# EasyEDA Pro project 电源板48-24 (0524).eprj, board PCB
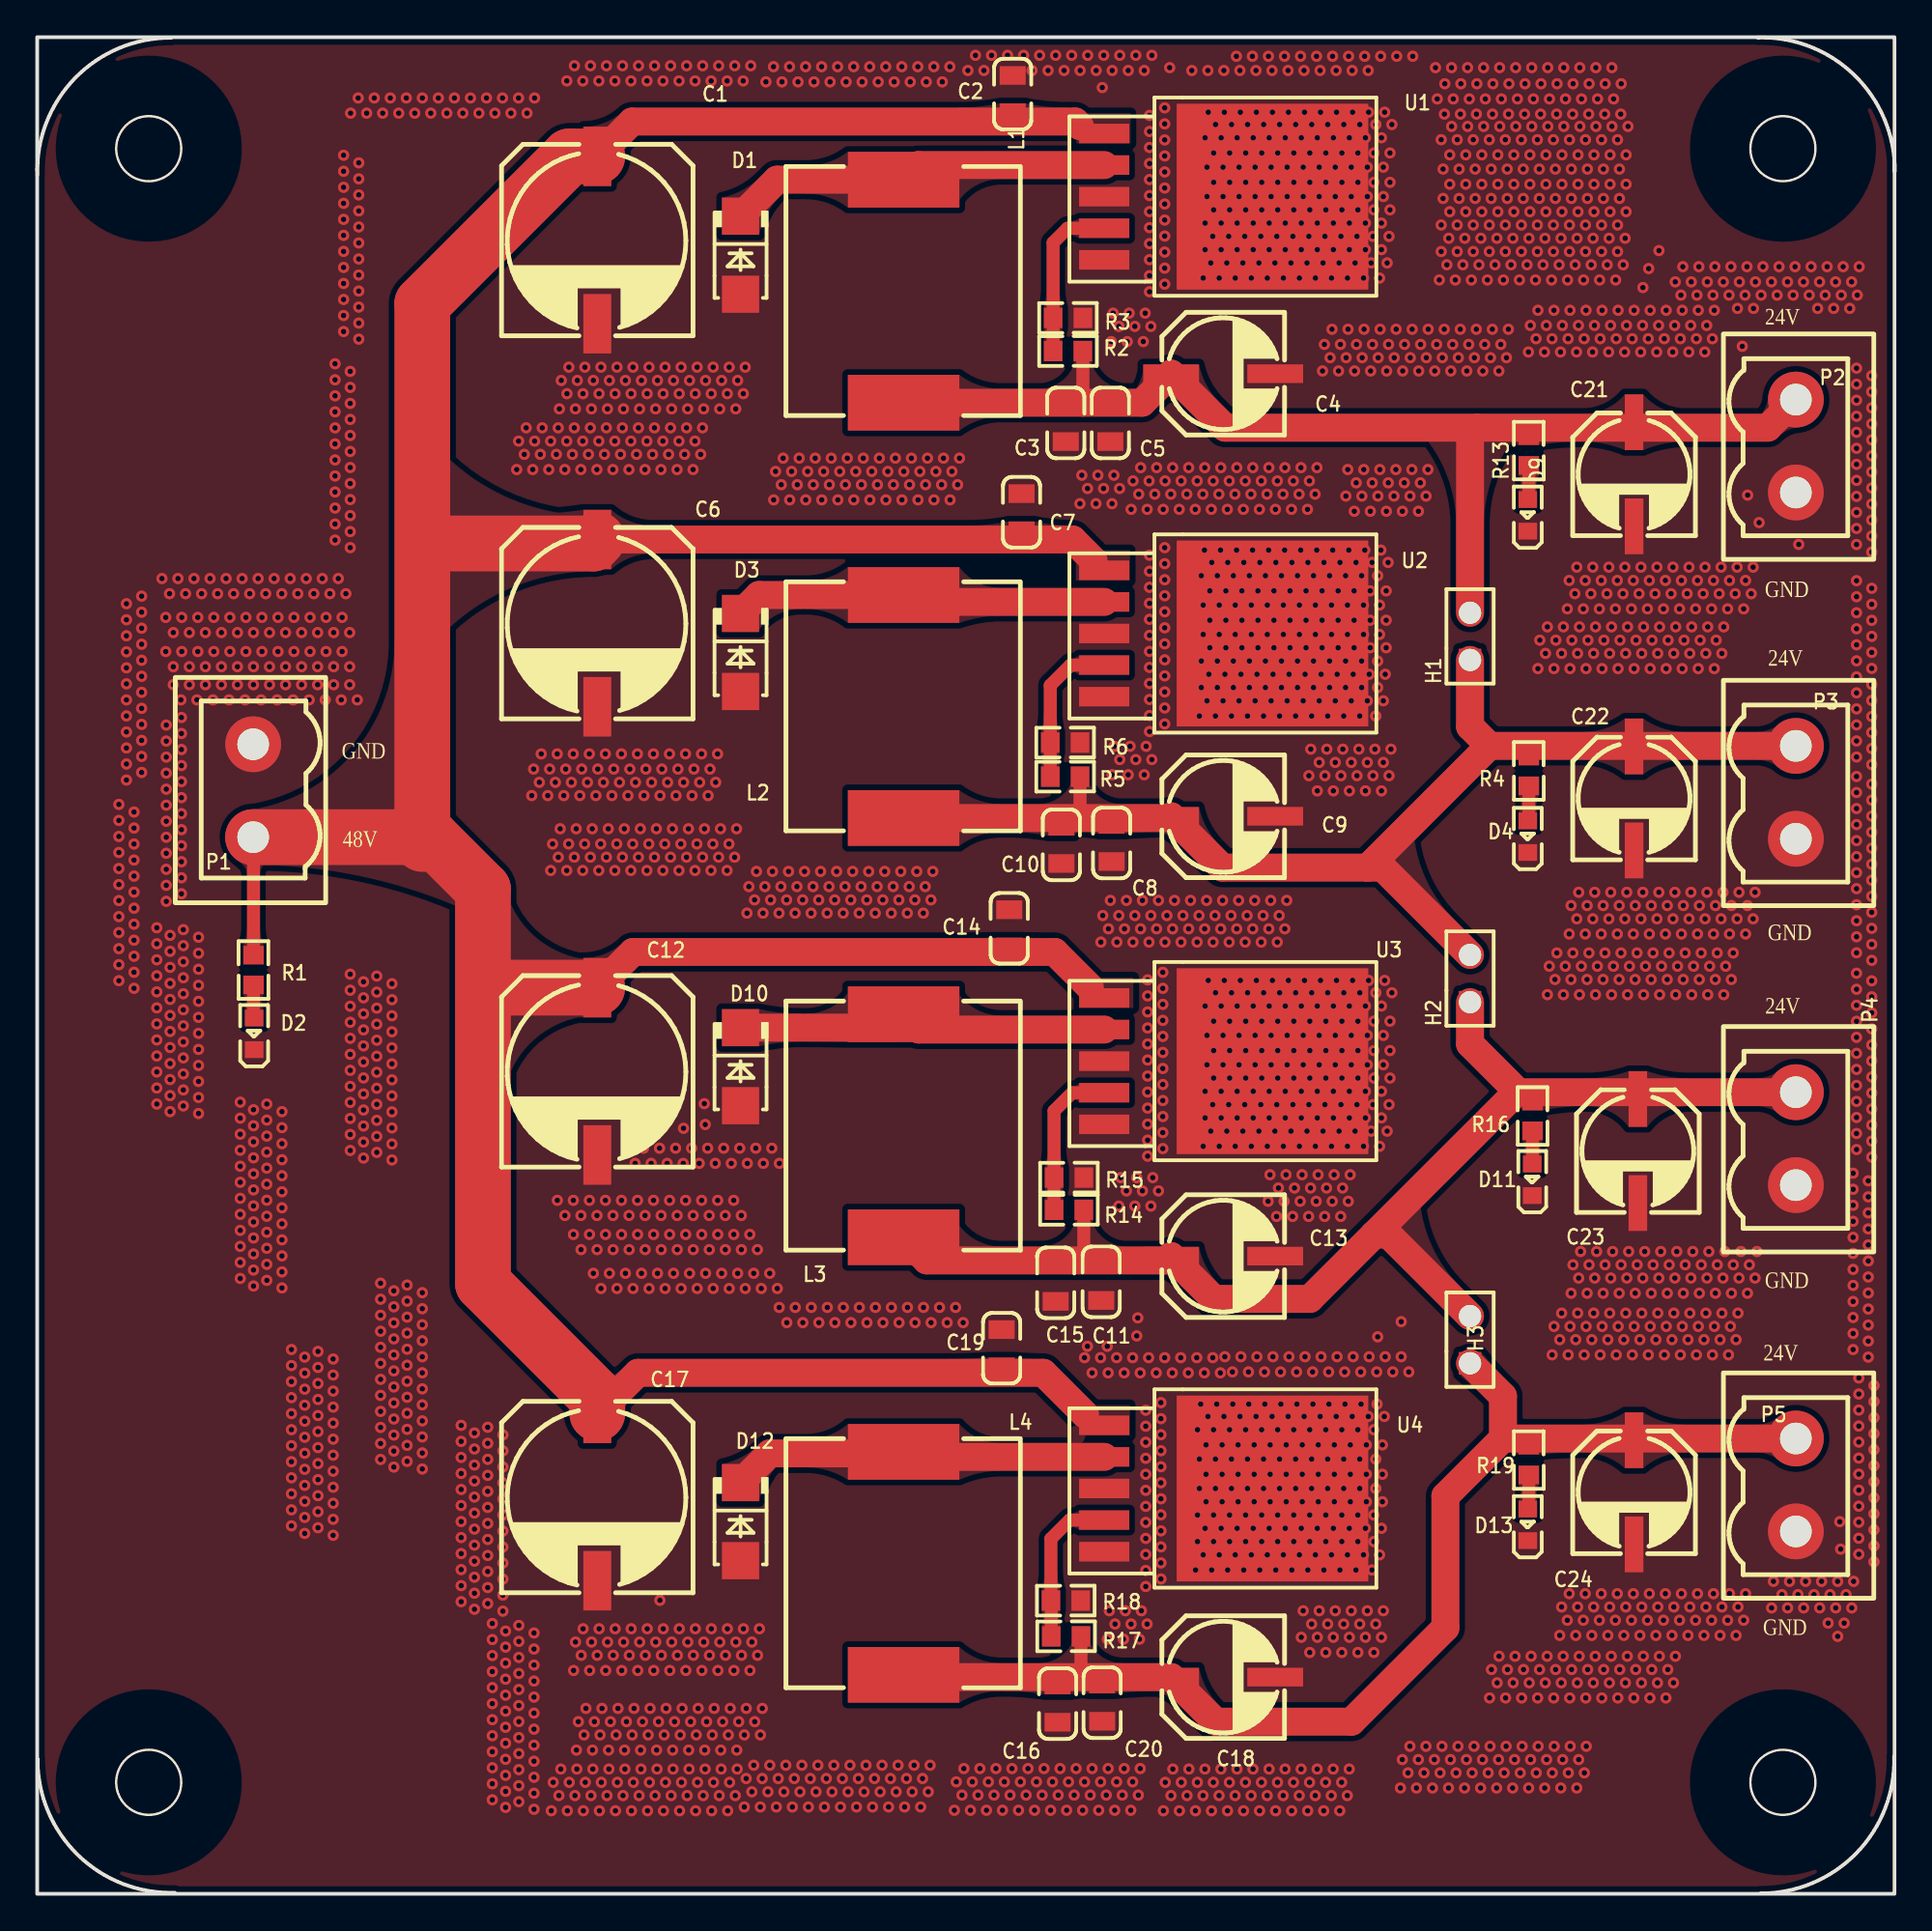
[diagram p1: board, top side]
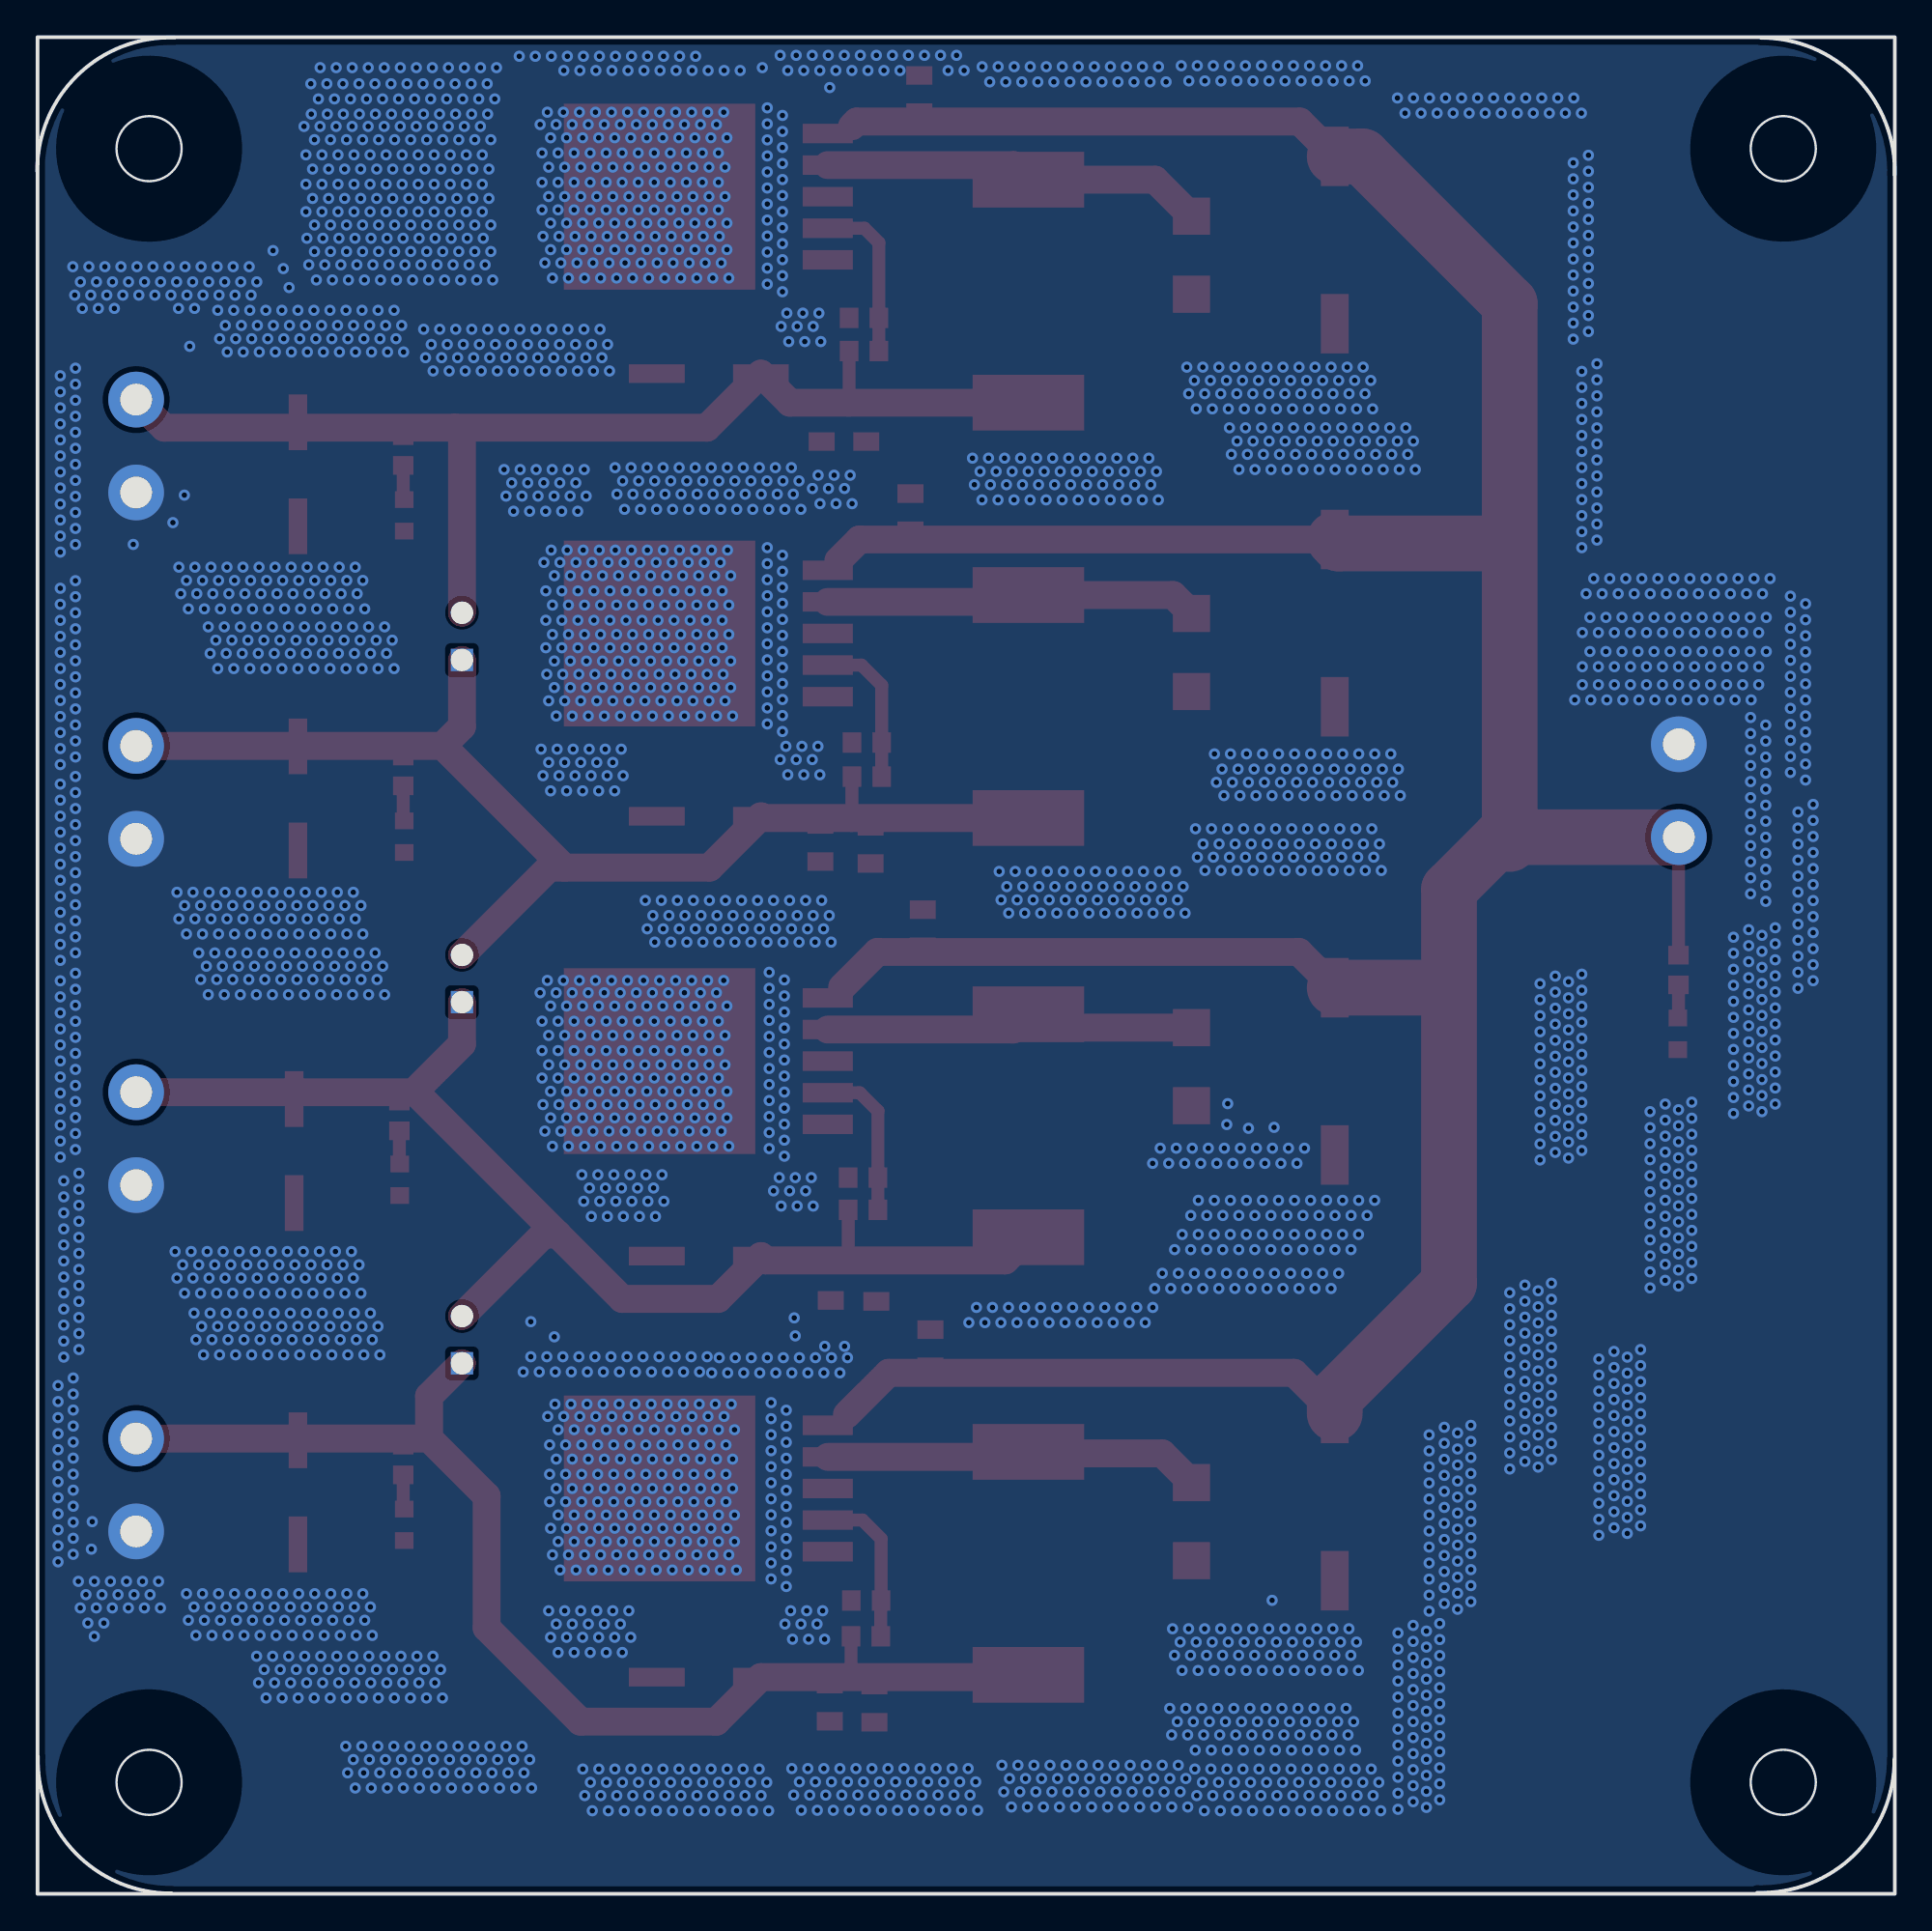
[diagram p2: board, bottom side, seen from below]

Outline 99.92 x 99.9 mm; copper layers: Top Layer, Bottom Layer. Coordinates in mm from the lower left corner of the outline.
Outline path: rectangle 0,99.9 99.9,0 ; circle c6,93.9 r1.75 ; circle c6,6 r1.75 ; circle c93.9,93.9 r1.75 ; circle c93.9,6 r1.75 ; 0.01,92.49 arc(2.04,97.7) 7.2,99.87 ; 7.4,0.06 arc(2.19,2.09) 0.02,7.25 ; 92.54,99.88 arc(97.75,97.85) 99.92,92.69 ; 99.88,7.4 arc(97.85,2.19) 92.69,0.02
Stack: Top Layer 0.035mm / Dielectric1 1.51mm FR4 er 4.5 / Bottom Layer 0.035mm

## Design rules (mm)
template: 用户自定义配置
spacing Default (default): track to track 0.152, other pairs 0 to 0.152
track width Default (default): min 0.254, default 0.254, max 25.4
differential pair differentialPair (default): width min 0.127, default 0.254, max 2.54; gap min 0.152, default 0.152
via Default (default): diameter min 0.25, default 0.61, max 100.025; hole min 0.2, default 0.305, max 59.995

## Placement (name value [footprint] x y rotation side)
C1  100uF/63V  [电解电容贴片10x10]  30.03 89.24 270 top
C2  104  [0805C]  52.47 96.84 270 top
C3  104  [0805C]  55.33 79.14 90 top
C4  100uF/35V  [电解电容贴片6X6]  63.79 81.79 0 top
C5  105  [0805C]  57.72 79.14 270 top
C6  100uF/63V  [电解电容贴片10x10]  30.03 68.63 270 top
C7  104  [0805C]  52.95 74.34 270 top
C8  104  [0805C]  57.79 56.54 90 top
C9  100uF/35V  [电解电容贴片6X6]  63.79 57.98 0 top
C10  105  [0805C]  55.09 56.44 270 top
C11  104  [0805C]  57.23 32.93 90 top
C12  100uF/63V  [电解电容贴片10x10]  30.03 44.51 270 top
C13  100uF/35V  [电解电容贴片6X6]  63.79 34.31 0 top
C14  104  [0805C]  52.28 51.95 270 top
C15  105  [0805C]  54.78 32.88 270 top
C16  104  [0805C]  54.88 10.23 90 top
C17  100uF/63V  [电解电容贴片10x10]  30.03 21.61 270 top
C18  100uF/35V  [电解电容贴片6X6]  63.79 11.66 0 top
C19  104  [0805C]  51.88 29.36 270 top
C20  105  [0805C]  57.28 10.28 270 top
C21  100uF/35V  [电解电容贴片6X6]  85.89 76.38 270 top
C22  100uF/35V  [电解电容贴片6X6]  85.89 58.94 270 top
C23  100uF/35V  [电解电容贴片6X6]  86.1 39.97 270 top
C24  100uF/35V  [电解电容贴片6X6]  85.89 21.61 270 top
D1  SS56  [SMA]  37.83 88.17 270 top
D2  红光  [0603LED]  11.69 46.24 270 top
D3  SS56  [SMA]  37.83 66.79 270 top
D4  红光  [0603LED]  80.19 56.85 270 top
D9  红光  [0603LED]  80.19 74.14 270 top
D10  SS56  [SMA]  37.83 44.51 270 top
D11  红光  [0603LED]  80.44 38.39 270 top
D12  SS56  [SMA]  37.83 20.03 270 top
D13  红光  [0603LED]  80.19 19.82 270 top
H1  PZ254V-11-02P  [HDR-TH_2P-P2.54-V-M]  77.07 67.66 90 top
H2  PZ254V-11-02P  [HDR-TH_2P-P2.54-V-M]  77.07 49.25 90 top
H3  PZ254V-11-02P  [HDR-TH_2P-P2.54-V-M]  77.07 29.82 90 top
L1  47uH/5A  [IND-SMD_L13.45-W12.6]  46.6 86.23 270 top
L2  47uH/5A  [IND-SMD_L13.45-W12.6]  46.6 63.89 270 top
L3  47uH/5A  [IND-SMD_L13.45-W12.6]  46.6 41.33 270 top
L4  47uH/5A  [IND-SMD_L13.45-W12.6]  46.6 17.78 270 top
P1  5.08-2P  [CONN-TH_WJ2EDGVC-5.08-2P]  11.62 59.35 90 top
P2  5.08-2P  [CONN-TH_WJ2EDGVC-5.08-2P]  94.6 77.9 270 top
P3  5.08-2P  [CONN-TH_WJ2EDGVC-5.08-2P]  94.6 59.27 270 top
P4  5.08-2P  [CONN-TH_WJ2EDGVC-5.08-2P]  94.6 40.63 270 top
P5  5.08-2P  [CONN-TH_WJ2EDGVC-5.08-2P]  94.6 22 270 top
R1  10K  [0603R]  11.64 49.71 90 top
R2  47K  [0603R]  55.45 83.01 0 top
R3  2.4K  [0603R]  55.45 84.8 180 top
R4  10K  [0603R]  80.23 60.42 90 top
R5  47K  [0603R]  55.29 60.11 0 top
R6  2.4K  [0603R]  55.29 61.95 180 top
R13  10K  [0603R]  80.23 77.66 90 top
R14  47K  [0603R]  55.5 36.8 0 top
R15  2.4K  [0603R]  55.5 38.54 180 top
R16  10K  [0603R]  80.44 41.85 90 top
R17  47K  [0603R]  55.34 13.85 0 top
R18  2.4K  [0603R]  55.33 15.78 180 top
R19  10K  [0603R]  80.23 23.34 90 top
U1  LM2576HVS-ADJ  [TO-263]  61.92 91.32 270 top
U2  LM2576HVS-ADJ  [TO-263]  61.92 67.81 270 top
U3  LM2576HVS-ADJ  [TO-263]  61.92 44.8 270 top
U4  LM2576HVS-ADJ  [TO-263]  61.92 21.81 270 top

## Footprints (pads in the part's own frame, mm; a bottom-side part is the same pattern mirrored in y, then rotated)
0603LED
  rect 0.9x1 smd: 1(-0.884,-0.017) 2(0.816,-0.017)
0603R
  rect 1x1.1 smd: 1(-0.8,0) 2(0.8,0)
0805C
  rect 1x1.4 smd: 1(-1,0) 2(1,0)
CONN-TH_WJ2EDGVC-5.08-2P
  round 3 hole 1.7: 1(-2.499,0) 2(2.499,0)
HDR-TH_2P-P2.54-V-M
  rect 1.2x1.2 hole 1.2x0.8: 1(-1.27,0)
  round 1.2 hole 1.2x0.8: 2(1.27,0)
IND-SMD_L13.45-W12.6
  rect 3x6 smd: 1(-6,0) 2(6,0)
SMA
  rect 2x2 smd: 1(2.1,0) 2(-2.1,0)
TO-263
  rect 1.05x2.7 smd: 1(-3.4,-4.526) 2(-1.7,-4.526) 3(0,-4.526) 4(1.7,-4.526) 5(3.4,-4.526)
  rect 10x10.3 smd: 3(0,4.526)
电解电容贴片6X6
  rect 3x1 smd: 1(-2.8,0) 2(2.8,0)
电解电容贴片10x10
  rect 3.2x1.5 smd: 1(-4.242,0.097) 2(4.758,0.097)

## Nets
As in the schematic.

## Via types
v1: diameter 0.6, hole 0.3, Top Layer to Bottom Layer, 3299 vias

## Routing (per net, layer and track width the routed paths; a pad name or vN(x,y) marks a point on that pad's centre or on a via; arc(x,y) is an arc through that point)
24V_1: length 63.4
  Top Layer w0.7: 56.26,80.23 56.25,80.25 R2.2
  Top Layer w1.5: 77.46,78.89 77.07,78.5 H1.2 ; 77.46,78.89 93.08,78.89 P2.1 ; 77.46,78.89 63.9,78.89 C4.1 59.43,80.23 L1.2
24V_2: length 66.6
  Top Layer w0.7: 56.09,57.89 56.09,57.89 56.09,60.11
  Top Layer w1.5: H2.2 72.37,55.22 71.56,55.22 ; L2.2 60.9,57.89 C9.1 63.75,55.22 71.56,55.22 ; 78.11,61.77 P3.1 ; 78.11,61.77 71.56,55.22 ; 78.11,61.77 77.07,62.81 H1.1
24V_3: length 69.1
  Top Layer w0.7: 56.3,36.8 56.3,34.34 56.26,34.31
  Top Layer w1.5: 71.91,35.47 68.45,32.01 63.29,32.01 C13.1 60.76,34.08 47.85,34.08 L3.2 ; 71.91,35.47 79.57,43.13 P4.1 ; 71.91,35.47 72.69,35.47 H3.2 ; 79.36,43.43 77.07,45.73 H2.1
24V_4: length 66
  Top Layer w0.7: 56.11,12.17 56.14,12.21 R17.2
  Top Layer w1.5: P5.1 78.84,24.5 ; 78.84,24.5 75.74,21.4 75.74,14.31 70.69,9.26 63.39,9.26 C18.1 46.72,11.66 L4.2 ; 78.84,24.5 78.84,26.78 H3.1
48V_IN: length 216.7
  Top Layer w0.7: P1.1 11.64,56.84 R1.2
  Top Layer w1.5: C12.1 32.05,50.68 54.73,50.68 56.62,48.79 ; C17.1 32.31,28.03 54.12,28.03 56.36,25.79 ; C1.1 32,95.36 55.84,95.36 56.09,95.11 ; C6.1 55.69,72.87 56.82,71.74
  Top Layer w3: C6.1 29.91,72.66 21.22,72.66 ; 20.71,56.49 20.71,56.86 ; 20.71,56.86 P1.1 ; 20.71,56.86 20.71,85.56 28.64,93.48 C1.1 ; 20.71,56.86 21.17,56.86 23.98,54.04 23.98,32.85 30.13,26.7 C17.1 ; C12.1 25,48.76
GND:
  vias: v1(4.39,58.62) v1(4.39,57.76) v1(4.39,56.89) v1(4.39,56.03) v1(4.39,55.17) v1(4.39,54.31) v1(4.39,53.44) v1(4.39,52.58) v1(4.39,51.72) v1(4.39,50.86) v1(4.39,49.99) v1(4.39,49.13) v1(4.8,69.42) v1(4.8,68.55) v1(4.8,67.69) v1(4.8,66.83) v1(4.8,65.97) v1(4.8,65.1) v1(4.8,64.24) v1(4.8,63.38) v1(4.8,62.52) v1(4.8,61.65) v1(4.8,60.79) v1(4.8,59.93) v1(5.21,58.21) v1(5.21,57.35) v1(5.21,56.49) v1(5.21,55.62) v1(5.21,54.76) v1(5.21,53.9) v1(5.21,53.04) v1(5.21,52.17) v1(5.21,51.31) v1(5.21,50.45) v1(5.21,49.59) v1(5.21,48.72) v1(5.62,69.82) v1(5.62,68.96) v1(5.62,68.1) v1(5.62,67.24) v1(5.62,66.37) v1(5.62,65.51) v1(5.62,64.65) v1(5.62,63.79) v1(5.62,62.92) v1(5.62,62.06) v1(5.62,61.2) v1(5.62,60.34) v1(6.43,51.98) v1(6.43,51.12) v1(6.43,50.26) v1(6.43,49.39) v1(6.43,48.53) v1(6.43,47.67) v1(6.43,46.81) v1(6.43,45.94) v1(6.43,45.08) v1(6.43,44.22) v1(6.43,43.36) v1(6.43,42.5) v1(6.71,70.77) v1(6.91,68.68) v1(6.91,66.84) v1(6.94,62.89) v1(6.94,62.02) v1(6.94,61.16) v1(6.94,60.3) v1(6.94,59.44) v1(6.94,58.58) v1(6.94,57.71) v1(6.94,56.85) v1(6.94,55.99) v1(6.94,55.13) v1(6.94,54.26) v1(6.94,53.4) v1(7.12,69.96) v1(7.15,51.57) v1(7.15,50.71) v1(7.15,49.85) v1(7.15,48.99) v1(7.15,48.12) v1(7.15,47.26) v1(7.15,46.4) v1(7.15,45.54) v1(7.15,44.67) v1(7.15,43.81) v1(7.15,42.95) v1(7.15,42.09) v1(7.32,67.86) v1(7.32,66.03) v1(7.32,65.06) v1(7.57,70.77) v1(7.78,68.68) v1(7.78,66.84) v1(7.73,64.24) v1(7.76,63.3) v1(7.76,62.43) v1(7.76,61.57) v1(7.76,60.71) v1(7.76,59.85) v1(7.76,58.98) v1(7.76,58.12) v1(7.76,57.26) v1(7.76,56.4) v1(7.76,55.53) v1(7.76,54.67) v1(7.76,53.81) v1(7.86,51.88) v1(7.86,51.02) v1(7.86,50.15) v1(7.86,49.29) v1(7.86,48.43) v1(7.86,47.57) v1(7.86,46.71) v1(7.86,45.84) v1(7.86,44.98) v1(7.86,44.12) v1(7.86,43.26) v1(7.86,42.39) v1(7.98,69.96) v1(8.18,67.86) v1(8.18,66.03) v1(8.18,65.06) v1(8.44,70.77) v1(8.59,64.24) v1(8.64,68.68) v1(8.64,66.84) v1(8.68,51.47) v1(8.68,50.61) v1(8.68,49.75) v1(8.68,48.88) v1(8.68,48.02) v1(8.68,47.16) v1(8.68,46.3) v1(8.68,45.43) v1(8.68,44.57) v1(8.68,43.71) v1(8.68,42.85) v1(8.68,41.99) v1(8.84,69.96) v1(9.05,67.86) v1(9.05,66.03) v1(9.05,65.06) v1(9.3,70.77) v1(9.5,68.68) v1(9.5,66.84) v1(9.45,64.24) v1(9.7,69.96) v1(9.91,67.86) v1(9.91,66.03) v1(9.91,65.06) v1(10.16,70.77) v1(10.36,68.68) v1(10.36,66.84) v1(10.32,64.24) v1(10.57,69.96) v1(10.77,67.86) v1(10.77,66.03) v1(10.77,65.06) v1(10.92,42.6) v1(10.92,41.73) v1(10.92,40.87) v1(10.92,40.01) v1(10.92,39.15) v1(10.92,38.29) v1(10.92,37.42) v1(10.92,36.56) v1(10.92,35.7) v1(10.92,34.84) v1(10.92,33.97) v1(10.92,33.11) v1(11.02,70.77) v1(11.18,64.24) v1(11.23,68.68) v1(11.23,66.84) v1(11.43,69.96) v1(11.63,67.86) v1(11.63,66.03) v1(11.63,65.06) v1(11.64,42.19) v1(11.64,41.33) v1(11.64,40.46) v1(11.64,39.6) v1(11.64,38.74) v1(11.64,37.88) v1(11.64,37.02) v1(11.64,36.15) v1(11.64,35.29) v1(11.64,34.43) v1(11.64,33.57) v1(11.64,32.7) v1(11.88,70.77) v1(12.09,68.68) v1(12.09,66.84) v1(12.04,64.24) v1(12.29,69.96) v1(12.35,42.5) v1(12.35,41.63) v1(12.35,40.77) v1(12.35,39.91) v1(12.35,39.05) v1(12.35,38.18) v1(12.35,37.32) v1(12.35,36.46) v1(12.35,35.6) v1(12.35,34.73) v1(12.35,33.87) v1(12.35,33.01) v1(12.5,67.86) v1(12.5,66.03) v1(12.5,65.06) v1(12.75,70.77) v1(12.9,64.24) v1(12.95,68.68) v1(12.95,66.84) v1(13.15,69.96) v1(13.17,42.09) v1(13.17,41.22) v1(13.17,40.36) v1(13.17,39.5) v1(13.17,38.64) v1(13.17,37.78) v1(13.17,36.91) v1(13.17,36.05) v1(13.17,35.19) v1(13.17,34.33) v1(13.17,33.46) v1(13.17,32.6) v1(13.36,67.86) v1(13.36,66.03) v1(13.36,65.06) v1(13.61,70.77) v1(13.68,29.29) v1(13.68,28.42) v1(13.68,27.56) v1(13.68,26.7) v1(13.68,25.84) v1(13.68,24.97) v1(13.68,24.11) v1(13.68,23.25) v1(13.68,22.39) v1(13.68,21.52) v1(13.68,20.66) v1(13.68,19.8) v1(13.77,64.24) v1(13.81,68.68) v1(13.81,66.84) v1(14.02,69.96) v1(14.22,67.86) v1(14.22,66.03) v1(14.22,65.06) v1(14.39,28.88) v1(14.39,28.02) v1(14.39,27.15) v1(14.39,26.29) v1(14.39,25.43) v1(14.39,24.57) v1(14.39,23.7) v1(14.39,22.84) v1(14.39,21.98) v1(14.39,21.12) v1(14.39,20.25) v1(14.39,19.39) v1(14.47,70.77) v1(14.68,68.68) v1(14.68,66.84) v1(14.63,64.24) v1(14.88,69.96) v1(15.08,67.86) v1(15.08,66.03) v1(15.08,65.06) v1(15.1,29.18) v1(15.1,28.32) v1(15.1,27.46) v1(15.1,26.6) v1(15.1,25.73) v1(15.1,24.87) v1(15.1,24.01) v1(15.1,23.15) v1(15.1,22.28) v1(15.1,21.42) v1(15.1,20.56) v1(15.1,19.7) v1(15.33,70.77) v1(15.49,64.24) v1(15.54,68.68) v1(15.54,66.84) v1(15.74,69.96) v1(15.95,67.86) v1(15.95,66.03) v1(15.95,65.06) v1(15.92,28.78) v1(15.92,27.91) v1(15.92,27.05) v1(15.92,26.19) v1(15.92,25.33) v1(15.92,24.46) v1(15.92,23.6) v1(15.92,22.74) v1(15.92,21.88) v1(15.92,21.01) v1(15.92,20.15) v1(15.92,19.29) v1(16.02,82.33) v1(16.02,81.46) v1(16.02,80.6) v1(16.02,79.74) v1(16.02,78.88) v1(16.02,78.01) v1(16.02,77.15) v1(16.02,76.29) v1(16.02,75.43) v1(16.02,74.57) v1(16.02,73.7) v1(16.02,72.84) v1(16.2,70.77) v1(16.4,68.68) v1(16.4,66.84) v1(16.35,64.24) v1(16.48,93.55) v1(16.48,92.68) v1(16.48,91.82) v1(16.48,90.96) v1(16.48,90.1) v1(16.48,89.24) v1(16.48,88.37) v1(16.48,87.51) v1(16.48,86.65) v1(16.48,85.79) v1(16.48,84.92) v1(16.48,84.06) v1(16.6,69.96) v1(16.86,95.81) v1(16.84,81.92) v1(16.84,81.06) v1(16.84,80.19) v1(16.84,79.33) v1(16.84,78.47) v1(16.84,77.61) v1(16.84,76.74) v1(16.84,75.88) v1(16.84,75.02) v1(16.84,74.16) v1(16.84,73.3) v1(16.84,72.43) v1(16.81,67.86) v1(16.81,66.03) v1(16.81,65.06) v1(16.84,49.48) v1(16.84,48.62) v1(16.84,47.76) v1(16.84,46.9) v1(16.84,46.03) v1(16.84,45.17) v1(16.84,44.31) v1(16.84,43.45) v1(16.84,42.58) v1(16.84,41.72) v1(16.84,40.86) v1(16.84,40) v1(17.27,96.63) v1(17.3,93.14) v1(17.3,92.28) v1(17.3,91.41) v1(17.3,90.55) v1(17.3,89.69) v1(17.3,88.83) v1(17.3,87.96) v1(17.3,87.1) v1(17.3,86.24) v1(17.3,85.38) v1(17.3,84.52) v1(17.3,83.65) v1(17.22,64.24) v1(17.55,49.07) v1(17.55,48.21) v1(17.55,47.35) v1(17.55,46.49) v1(17.55,45.62) v1(17.55,44.76) v1(17.55,43.9) v1(17.55,43.04) v1(17.55,42.18) v1(17.55,41.31) v1(17.55,40.45) v1(17.55,39.59) v1(17.72,95.81) v1(18.13,96.63) v1(18.27,49.38) v1(18.27,48.52) v1(18.27,47.66) v1(18.27,46.79) v1(18.27,45.93) v1(18.27,45.07) v1(18.27,44.21) v1(18.27,43.34) v1(18.27,42.48) v1(18.27,41.62) v1(18.27,40.76) v1(18.27,39.89) v1(18.47,32.86) v1(18.47,31.99) v1(18.47,31.13) v1(18.47,30.27) v1(18.47,29.41) v1(18.47,28.54) v1(18.47,27.68) v1(18.47,26.82) v1(18.47,25.96) v1(18.47,25.09) v1(18.47,24.23) v1(18.47,23.37) v1(18.58,95.81) v1(18.99,96.63) v1(19.08,48.97) v1(19.08,48.11) v1(19.08,47.25) v1(19.08,46.39) v1(19.08,45.52) v1(19.08,44.66) v1(19.08,43.8) v1(19.08,42.94) v1(19.08,42.07) v1(19.08,41.21) v1(19.08,40.35) v1(19.08,39.49) v1(19.18,32.45) v1(19.18,31.59) v1(19.18,30.72) v1(19.18,29.86) v1(19.18,29) v1(19.18,28.14) v1(19.18,27.27) v1(19.18,26.41) v1(19.18,25.55) v1(19.18,24.69) v1(19.18,23.82) v1(19.18,22.96) v1(19.45,95.81) v1(19.85,96.63) v1(19.9,32.75) v1(19.9,31.89) v1(19.9,31.03) v1(19.9,30.17) v1(19.9,29.3) v1(19.9,28.44) v1(19.9,27.58) v1(19.9,26.72) v1(19.9,25.86) v1(19.9,24.99) v1(19.9,24.13) v1(19.9,23.27) v1(20.31,95.81) v1(20.72,96.63) v1(20.71,32.35) v1(20.71,31.48) v1(20.71,30.62) v1(20.71,29.76) v1(20.71,28.9) v1(20.71,28.03) v1(20.71,27.17) v1(20.71,26.31) v1(20.71,25.45) v1(20.71,24.58) v1(20.71,23.72) v1(20.71,22.86) v1(21.17,95.81) v1(21.58,96.63) v1(22.03,95.81) v1(22.44,96.63) v1(22.8,25.21) v1(22.8,24.34) v1(22.8,23.48) v1(22.8,22.62) v1(22.8,21.76) v1(22.8,20.89) v1(22.8,20.03) v1(22.8,19.17) v1(22.8,18.31) v1(22.8,17.44) v1(22.8,16.58) v1(22.8,15.72) v1(22.9,95.81) v1(23.3,96.63) v1(23.52,24.8) v1(23.52,23.94) v1(23.52,23.07) v1(23.52,22.21) v1(23.52,21.35) v1(23.52,20.49) v1(23.52,19.62) v1(23.52,18.76) v1(23.52,17.9) v1(23.52,17.04) v1(23.52,16.17) v1(23.52,15.31) v1(23.76,95.81) v1(24.17,96.63) v1(24.23,25.1) v1(24.23,24.24) v1(24.23,23.38) v1(24.23,22.52) v1(24.23,21.65) v1(24.23,20.79) v1(24.23,19.93) v1(24.23,19.07) v1(24.23,18.21) v1(24.23,17.34) v1(24.23,16.48) v1(24.23,15.62) v1(24.48,14.55) v1(24.48,13.68) v1(24.48,12.82) v1(24.48,11.96) v1(24.48,11.1) v1(24.48,10.23) v1(24.48,9.37) v1(24.48,8.51) v1(24.48,7.65) v1(24.48,6.78) v1(24.48,5.92) v1(24.48,5.06) v1(24.62,95.81) v1(25.03,96.63) v1(25.05,24.7) v1(25.05,23.83) v1(25.05,22.97) v1(25.05,22.11) v1(25.05,21.25) v1(25.05,20.38) v1(25.05,19.52) v1(25.05,18.66) v1(25.05,17.8) v1(25.05,16.93) v1(25.05,16.07) v1(25.05,15.21) v1(25.19,14.14) v1(25.19,13.27) v1(25.19,12.41) v1(25.19,11.55) v1(25.19,10.69) v1(25.19,9.83) v1(25.19,8.96) v1(25.19,8.1) v1(25.19,7.24) v1(25.19,6.38) v1(25.19,5.51) v1(25.19,4.65) v1(25.48,95.81) v1(25.79,76.64) v1(25.89,96.63) v1(25.89,78.17) v1(25.91,14.44) v1(25.91,13.58) v1(25.91,12.72) v1(25.91,11.86) v1(25.91,10.99) v1(25.91,10.13) v1(25.91,9.27) v1(25.91,8.41) v1(25.91,7.54) v1(25.91,6.68) v1(25.91,5.82) v1(25.91,4.96) v1(26.2,77.45) v1(26.3,78.88) v1(26.35,95.81) v1(26.6,59.09) v1(26.66,76.64) v1(26.7,60.52) v1(26.75,96.63) v1(26.76,78.17) v1(26.72,14.03) v1(26.72,13.17) v1(26.72,12.31) v1(26.72,11.45) v1(26.72,10.59) v1(26.72,9.72) v1(26.72,8.86) v1(26.72,8) v1(26.72,7.14) v1(26.72,6.27) v1(26.72,5.41) v1(26.72,4.55) v1(27.06,77.45) v1(27.01,59.81) v1(27.16,78.88) v1(27.11,61.34) v1(27.46,59.09) v1(27.52,76.64) v1(27.56,60.52) v1(27.62,78.17) v1(27.62,55.06) v1(27.65,4.47) v1(27.72,56.49) v1(27.76,6) v1(27.87,59.81) v1(27.93,77.45) v1(27.97,61.34) v1(27.98,37.31) v1(28.09,79.9) v1(28.03,78.88) v1(28.03,55.78) v1(28.06,5.29) v1(28.19,81.43) v1(28.13,57.31) v1(28.16,6.71) v1(28.38,76.64) v1(28.32,59.09) v1(28.39,36.5) v1(28.49,97.55) v1(28.5,80.72) v1(28.48,78.17) v1(28.43,60.52) v1(28.48,55.06) v1(28.6,82.14) v1(28.58,56.49) v1(28.52,4.47) v1(28.62,6) v1(28.79,77.45) v1(28.73,59.81) v1(28.9,98.36) v1(28.89,78.88) v1(28.84,61.34) v1(28.89,55.78) v1(28.84,37.31) v1(28.84,35.48) v1(28.85,12.02) v1(28.95,79.9) v1(28.99,57.31) v1(28.95,13.55) v1(28.92,5.29) v1(29.05,81.43) v1(29.01,7.73) v1(29.03,6.71) v1(29.19,59.09) v1(29.11,9.26) v1(29.24,76.64) v1(29.29,60.52) v1(29.25,36.5) v1(29.25,34.66) v1(29.26,12.83) v1(29.35,97.55) v1(29.36,80.72) v1(29.34,78.17) v1(29.34,55.06) v1(29.36,14.26) v1(29.38,4.47) v1(29.46,82.14) v1(29.45,56.49) v1(29.41,8.55) v1(29.48,6) v1(29.6,59.81) v1(29.52,9.98) v1(29.65,77.45) v1(29.7,61.34) v1(29.7,37.31) v1(29.76,98.36) v1(29.75,78.88) v1(29.75,55.78) v1(29.71,35.48) v1(29.72,12.02) v1(29.79,5.29) v1(29.81,79.9) v1(29.85,57.31) v1(29.82,13.55) v1(29.87,7.73) v1(29.89,6.71) v1(29.91,81.43) v1(29.92,33.39) v1(29.97,9.26) v1(30.1,76.64) v1(30.05,59.09) v1(30.15,60.52) v1(30.11,36.5) v1(30.12,34.66) v1(30.12,12.83) v1(30.21,97.55) v1(30.22,80.72) v1(30.21,78.17) v1(30.21,55.06) v1(30.22,14.26) v1(30.28,8.55) v1(30.24,4.47) v1(30.32,82.14) v1(30.31,56.49) v1(30.32,32.57) v1(30.38,9.98) v1(30.34,6) v1(30.46,59.81) v1(30.51,77.45) v1(30.56,61.34) v1(30.56,37.31) v1(30.57,35.48) v1(30.58,12.02) v1(30.62,98.36) v1(30.67,79.9) v1(30.61,78.88) v1(30.62,55.78) v1(30.68,13.55) v1(30.65,5.29) v1(30.78,81.43) v1(30.72,57.31) v1(30.78,33.39) v1(30.73,7.73) v1(30.75,6.71) v1(30.83,9.26) v1(30.97,76.64) v1(30.91,59.09) v1(30.97,36.5) v1(30.98,34.66) v1(30.99,12.83) v1(31.07,97.55) v1(31.08,80.72) v1(31.07,78.17) v1(31.01,60.52) v1(31.07,55.06) v1(31.09,14.26) v1(31.1,4.47) v1(31.19,82.14) v1(31.17,56.49) v1(31.19,32.57) v1(31.14,8.55) v1(31.2,6) v1(31.24,9.98) v1(31.38,77.45) v1(31.32,59.81) v1(31.48,98.36) v1(31.48,78.88) v1(31.42,61.34) v1(31.48,55.78) v1(31.43,37.31) v1(31.43,35.48) v1(31.44,12.02) v1(31.54,79.9) v1(31.58,57.31) v1(31.54,13.55) v1(31.59,7.73) v1(31.51,5.29) v1(31.64,81.43) v1(31.64,33.39) v1(31.69,9.26) v1(31.61,6.71) v1(31.77,59.09) v1(31.75,40.12) v1(31.83,76.64) v1(31.88,60.52) v1(31.84,36.5) v1(31.84,34.66) v1(31.85,12.83) v1(31.94,97.55) v1(31.94,80.72) v1(31.93,78.17) v1(31.93,55.06) v1(31.95,14.26) v1(32,8.55) v1(31.97,4.47) v1(32.05,82.14) v1(32.03,56.49) v1(32.05,32.57) v1(32.1,9.98) v1(32.07,6) v1(32.18,59.81) v1(32.16,39.3) v1(32.24,77.45) v1(32.28,61.34) v1(32.29,37.31) v1(32.29,35.48) v1(32.3,12.02) v1(32.34,98.36) v1(32.4,79.9) v1(32.34,78.88) v1(32.34,55.78) v1(32.4,13.55) v1(32.37,5.29) v1(32.5,81.43) v1(32.44,57.31) v1(32.5,33.39) v1(32.45,7.73) v1(32.48,6.71) v1(32.56,9.26) v1(32.69,76.64) v1(32.64,59.09) v1(32.61,40.12) v1(32.7,36.5) v1(32.7,34.66) v1(32.8,97.55) v1(32.79,78.17) v1(32.74,60.52) v1(32.79,55.06) v1(32.71,12.83) v1(32.81,80.72) v1(32.9,56.49) v1(32.81,14.26) v1(32.86,8.55) v1(32.83,4.47) v1(32.91,82.14) v1(32.91,32.57) v1(32.97,9.98) v1(32.93,6) v1(33.1,77.45) v1(33.04,59.81) v1(33.02,39.3) v1(33.2,78.88) v1(33.15,61.34) v1(33.2,55.78) v1(33.15,37.31) v1(33.16,35.48) v1(33.16,12.02) v1(33.21,98.36) v1(33.26,79.9) v1(33.3,57.31) v1(33.27,13.55) v1(33.24,5.29) v1(33.36,81.43) v1(33.39,41.24) v1(33.37,33.39) v1(33.32,7.73) v1(33.34,6.71) v1(33.5,59.09) v1(33.48,40.12) v1(33.49,15.79) v1(33.42,9.26) v1(33.55,76.64) v1(33.6,60.52) v1(33.56,36.5) v1(33.56,34.66) v1(33.57,12.83) v1(33.66,97.55) v1(33.67,80.72) v1(33.66,78.17) v1(33.66,55.06) v1(33.67,14.26) v1(33.69,4.47) v1(33.77,82.14) v1(33.76,56.49) v1(33.77,32.57) v1(33.73,8.55) v1(33.79,6) v1(33.88,39.3) v1(33.83,9.98) v1(33.96,77.45) v1(33.91,59.81) v1(34.07,98.36) v1(34.06,78.88) v1(34.01,61.34) v1(34.06,55.78) v1(34.01,37.31) v1(34.02,35.48) v1(34.03,12.02) v1(34.1,5.29) v1(34.12,79.9) v1(34.17,57.31) v1(34.13,13.55) v1(34.18,7.73) v1(34.2,6.71) v1(34.23,81.43) v1(34.23,33.39) v1(34.28,9.26) v1(34.36,59.09) v1(34.34,40.12) v1(34.42,76.64) v1(34.46,60.52) v1(34.42,36.5) v1(34.43,34.66) v1(34.44,12.83) v1(34.52,97.55) v1(34.53,80.72) v1(34.52,78.17) v1(34.52,55.06) v1(34.54,14.26) v1(34.59,8.55) v1(34.55,4.47) v1(34.63,82.14) v1(34.62,56.49) v1(34.64,32.57) v1(34.69,9.98) v1(34.65,6) v1(34.77,59.81) v1(34.76,41.19) v1(34.75,39.3) v1(34.82,77.45) v1(34.87,61.34) v1(34.88,37.31) v1(34.88,35.48) v1(34.89,12.02) v1(34.93,98.36) v1(34.99,79.9) v1(34.93,78.88) v1(34.93,55.78) v1(34.99,13.55) v1(34.96,5.29) v1(35.09,81.43) v1(35.03,57.31) v1(35.09,33.39) v1(35.04,7.73) v1(35.06,6.71) v1(35.2,40.12) v1(35.14,9.26) v1(35.28,76.64) v1(35.22,59.09) v1(35.28,36.5) v1(35.29,34.66) v1(35.3,12.83) v1(35.39,97.55) v1(35.39,80.72) v1(35.38,78.17) v1(35.33,60.52) v1(35.38,55.06) v1(35.4,14.26) v1(35.5,82.14) v1(35.48,56.49) v1(35.5,32.57) v1(35.45,8.55) v1(35.41,4.47) v1(35.55,9.98) v1(35.52,6) v1(35.69,77.45) v1(35.63,59.81) v1(35.61,39.3) v1(35.79,98.36) v1(35.79,78.88) v1(35.73,61.34) v1(35.79,55.78) v1(35.74,37.31) v1(35.74,35.48) v1(35.75,12.02) v1(35.85,79.9) v1(35.89,57.31) v1(35.88,42.52) v1(35.85,13.55) v1(35.9,7.73) v1(35.82,5.29) v1(35.95,81.43) v1(35.93,41.39) v1(35.95,33.39) v1(35.92,6.71) v1(36.09,59.09) v1(36.06,40.12) v1(36.01,9.26) v1(36.19,60.52) v1(36.15,36.5) v1(36.15,34.66) v1(36.16,12.83) v1(36.25,97.55) v1(36.26,80.72) v1(36.24,55.06) v1(36.26,14.26) v1(36.28,4.47) v1(36.36,82.14) v1(36.35,56.49) v1(36.36,32.57) v1(36.31,8.55) v1(36.38,6) v1(36.49,59.81) v1(36.47,39.3) v1(36.41,9.98) v1(36.6,61.34) v1(36.6,37.31) v1(36.66,98.36) v1(36.65,55.78) v1(36.61,35.48) v1(36.61,12.02) v1(36.69,5.29) v1(36.71,79.9) v1(36.75,57.31) v1(36.72,13.55) v1(36.77,7.73) v1(36.79,6.71) v1(36.81,81.43) v1(36.81,33.39) v1(36.87,9.26) v1(36.93,40.12) v1(37.01,36.5) v1(37.01,34.66) v1(37.02,12.83) v1(37.11,97.55) v1(37.12,80.72) v1(37.11,55.06) v1(37.12,14.26) v1(37.17,8.55) v1(37.14,4.47) v1(37.22,82.14) v1(37.21,56.49) v1(37.22,32.57) v1(37.28,9.98) v1(37.24,6) v1(37.33,39.3) v1(37.46,37.31) v1(37.47,35.48) v1(37.48,12.02) v1(37.52,98.36) v1(37.57,79.9) v1(37.51,55.78) v1(37.58,13.55) v1(37.55,5.29) v1(37.68,81.43) v1(37.62,57.31) v1(37.68,33.39) v1(37.63,7.73) v1(37.65,6.71) v1(37.79,40.12) v1(37.73,9.26) v1(37.87,36.5) v1(37.88,34.66) v1(37.88,12.83) v1(37.97,97.55) v1(37.98,80.72) v1(37.99,14.26) v1(38.08,82.14) v1(38.09,32.57) v1(38.04,8.55) v1(38.03,4.67) v1(38.18,52.77) v1(38.2,39.3) v1(38.14,9.98) v1(38.13,6.2) v1(38.28,54.2) v1(38.38,98.36) v1(38.33,35.48) v1(38.34,12.02) v1(38.44,13.55) v1(38.44,5.49) v1(38.59,53.48) v1(38.54,33.39) v1(38.59,9.26) v1(38.54,6.92) v1(38.69,55.01) v1(38.65,40.12) v1(38.74,34.66) v1(38.75,12.83) v1(38.85,14.26) v1(38.9,8.55) v1(38.89,4.67) v1(38.95,32.57) v1(39,9.98) v1(39,6.2) v1(39.04,52.77) v1(39.06,39.3) v1(39.2,97.5) v1(39.14,54.2) v1(39.3,5.49) v1(39.4,33.39) v1(39.45,53.48) v1(39.41,6.92) v1(39.55,55.01) v1(39.51,40.12) v1(39.61,98.31) v1(39.61,75) v1(39.72,76.53) v1(39.76,4.67) v1(39.9,52.77) v1(39.81,32.57) v1(39.86,6.2) v1(40,54.2) v1(39.92,39.3) v1(39.91,31.55) v1(40.06,97.5) v1(40.02,75.82) v1(40.12,77.25) v1(40.17,5.49) v1(40.27,6.92) v1(40.31,53.48) v1(40.32,30.74) v1(40.47,98.31) v1(40.48,75) v1(40.41,55.01) v1(40.58,76.53) v1(40.62,4.67) v1(40.76,52.77) v1(40.77,31.55) v1(40.72,6.2) v1(40.88,75.82) v1(40.87,54.2) v1(40.92,97.5) v1(40.99,77.25) v1(41.03,5.49) v1(41.17,53.48) v1(41.18,30.74) v1(41.13,6.92) v1(41.27,55.01) v1(41.33,98.31) v1(41.34,75) v1(41.44,76.53) v1(41.48,4.67) v1(41.58,6.2) v1(41.63,52.77) v1(41.64,31.55) v1(41.78,97.5) v1(41.75,75.82) v1(41.73,54.2) v1(41.85,77.25) v1(41.89,5.49) v1(41.99,6.92) v1(42.03,53.48) v1(42.04,30.74) v1(42.19,98.31) v1(42.2,75) v1(42.14,55.01) v1(42.3,76.53) v1(42.34,4.67) v1(42.49,52.77) v1(42.5,31.55) v1(42.45,6.2) v1(42.59,54.2) v1(42.65,97.5) v1(42.61,75.82) v1(42.71,77.25) v1(42.75,5.49) v1(42.9,53.48) v1(42.85,6.92) v1(43,55.01) v1(42.91,30.74) v1(43.06,98.31) v1(43.06,75) v1(43.17,76.53) v1(43.21,4.67) v1(43.35,52.77) v1(43.36,31.55) v1(43.31,6.2) v1(43.47,75.82) v1(43.45,54.2) v1(43.51,97.5) v1(43.57,77.25) v1(43.62,5.49) v1(43.76,53.48) v1(43.77,30.74) v1(43.72,6.92) v1(43.86,55.01) v1(43.92,98.31) v1(43.93,75) v1(44.03,76.53) v1(44.07,4.67) v1(44.17,6.2) v1(44.21,52.77) v1(44.22,31.55) v1(44.37,97.5) v1(44.33,75.82) v1(44.32,54.2) v1(44.44,77.25) v1(44.48,5.49) v1(44.58,6.92) v1(44.62,53.48) v1(44.63,30.74) v1(44.78,98.31) v1(44.79,75) v1(44.72,55.01) v1(44.89,76.53) v1(44.93,4.67) v1(45.08,52.77) v1(45.09,31.55) v1(45.03,6.2) v1(45.2,75.82) v1(45.18,54.2) v1(45.23,97.5) v1(45.3,77.25) v1(45.34,5.49) v1(45.48,53.48) v1(45.49,30.74) v1(45.44,6.92) v1(45.59,55.01) v1(45.64,98.31) v1(45.65,75) v1(45.75,76.53) v1(45.79,4.67) v1(45.9,6.2) v1(45.94,52.77) v1(45.95,31.55) v1(46.1,97.5) v1(46.06,75.82) v1(46.04,54.2) v1(46.16,77.25) v1(46.2,5.49) v1(46.3,6.92) v1(46.35,53.48) v1(46.36,30.74) v1(46.5,98.31) v1(46.45,55.01) v1(46.51,75) v1(46.62,76.53) v1(46.66,4.67) v1(46.8,52.77) v1(46.76,6.2) v1(46.9,54.2) v1(46.81,31.55) v1(46.96,97.5) v1(46.92,75.82) v1(47.02,77.25) v1(47.06,5.49) v1(47.17,6.92) v1(47.21,53.48) v1(47.22,30.74) v1(47.37,98.31) v1(47.38,75) v1(47.31,55.01) v1(47.48,76.53) v1(47.52,4.67) v1(47.66,52.77) v1(47.67,31.55) v1(47.62,6.2) v1(47.78,75.82) v1(47.77,54.2) v1(47.82,97.5) v1(47.88,77.25) v1(47.93,5.49) v1(48.07,53.48) v1(48.08,30.74) v1(48.03,6.92) v1(48.17,55.01) v1(48.23,98.31) v1(48.24,75) v1(48.34,76.53) v1(48.54,31.55) v1(48.68,97.5) v1(48.65,75.82) v1(48.75,77.25) v1(48.94,30.74) v1(49.09,98.31) v1(49.1,75) v1(49.2,76.53) v1(49.4,31.55) v1(49.33,4.5) v1(49.44,6.03) v1(49.51,75.82) v1(49.61,77.25) v1(49.74,5.31) v1(49.81,30.74) v1(49.84,6.74) v1(50.06,98.11) v1(50.2,4.5) v1(50.3,6.03) v1(50.47,98.92) v1(50.6,5.31) v1(50.71,6.74) v1(50.92,98.11) v1(51.06,4.5) v1(51.16,6.03) v1(51.33,98.92) v1(51.47,5.31) v1(51.57,6.74) v1(51.92,4.5) v1(52.02,6.03) v1(52.19,98.92) v1(52.33,5.31) v1(52.43,6.74) v1(52.78,4.5) v1(52.88,6.03) v1(53.06,98.92) v1(53.19,5.31) v1(53.29,6.74) v1(53.51,98.11) v1(53.65,4.5) v1(53.75,6.03) v1(53.92,98.92) v1(54.05,5.31) v1(54.16,6.74) v1(54.37,98.11) v1(54.51,4.5) v1(54.61,6.03) v1(54.78,98.92) v1(54.92,5.31) v1(55.02,6.74) v1(55.23,98.11) v1(55.37,4.5) v1(55.47,6.03) v1(55.64,98.92) v1(55.78,5.31) v1(55.88,6.74) v1(56.1,98.11) v1(56.09,74.8) v1(56.19,76.33) v1(56.23,4.5) v1(56.33,28.85) v1(56.33,6.03) v1(56.5,75.62) v1(56.49,29.46) v1(56.51,98.92) v1(56.64,5.31) v1(56.74,28.03) v1(56.74,6.74) v1(56.96,98.11) v1(56.95,74.8) v1(57.05,76.33) v1(57.09,4.5) v1(57.2,28.85) v1(57.2,6.03) v1(57.29,97.19) v1(57.21,51.21) v1(57.37,98.92) v1(57.36,75.62) v1(57.32,52.64) v1(57.5,5.31) v1(57.56,29.46) v1(57.6,28.03) v1(57.57,13.7) v1(57.6,6.74) v1(57.62,51.92) v1(57.67,15.23) v1(57.77,83.52) v1(57.72,53.45) v1(57.82,98.11) v1(57.87,85.05) v1(57.81,74.8) v1(57.82,60.21) v1(57.91,76.33) v1(57.92,61.74) v1(57.97,14.52) v1(57.96,4.5) v1(58.08,51.21) v1(58.06,28.85) v1(58.06,6.03) v1(58.18,84.34) v1(58.18,52.64) v1(58.18,37.01) v1(58.23,98.92) v1(58.22,75.62) v1(58.23,61.03) v1(58.28,38.54) v1(58.37,5.31) v1(58.48,51.92) v1(58.47,28.03) v1(58.43,13.7) v1(58.47,6.74) v1(58.59,53.45) v1(58.59,37.82) v1(58.53,15.23) v1(58.68,98.11) v1(58.63,83.52) v1(58.68,60.21) v1(58.73,85.05) v1(58.79,61.74) v1(58.84,74.49) v1(58.84,14.52) v1(58.82,4.5) v1(58.94,76.02) v1(58.94,51.21) v1(58.92,28.85) v1(58.92,6.03) v1(59.09,98.92) v1(59.04,84.34) v1(59.09,61.03) v1(59.04,52.64) v1(59.04,37.01) v1(59.14,38.54) v1(59.2,30.99) v1(59.14,30.02) v1(59.25,75.31) v1(59.29,13.7) v1(59.23,5.31) v1(59.35,76.74) v1(59.35,51.92) v1(59.33,28.03) v1(59.39,15.23) v1(59.33,6.74) v1(59.5,83.52) v1(59.45,53.45) v1(59.45,37.82) v1(59.55,98.11) v1(59.6,85.05) v1(59.55,60.21) v1(59.7,74.49) v1(59.65,61.74) v1(59.63,26.02) v1(59.63,25.16) v1(59.63,24.3) v1(59.63,23.43) v1(59.63,22.57) v1(59.63,21.71) v1(59.63,20.85) v1(59.63,19.99) v1(59.63,19.12) v1(59.63,18.26) v1(59.63,17.4) v1(59.63,16.54) v1(59.7,14.52) v1(59.8,51.21) v1(59.73,49.18) v1(59.73,48.31) v1(59.73,47.45) v1(59.73,46.59) v1(59.73,45.73) v1(59.73,44.86) v1(59.73,44) v1(59.73,43.14) v1(59.73,42.28) v1(59.73,41.42) v1(59.73,40.55) v1(59.73,39.69) v1(59.78,28.85) v1(59.83,95.69) v1(59.83,94.83) v1(59.83,93.96) v1(59.83,93.1) v1(59.83,92.24) v1(59.83,91.38) v1(59.83,90.51) v1(59.83,89.65) v1(59.83,88.79) v1(59.83,87.93) v1(59.83,87.07) v1(59.83,86.2) v1(59.9,84.34) v1(59.81,76.02) v1(59.83,72.02) v1(59.83,71.16) v1(59.83,70.3) v1(59.83,69.44) v1(59.83,68.58) v1(59.83,67.71) v1(59.83,66.85) v1(59.83,65.99) v1(59.83,65.13) v1(59.83,64.26) v1(59.83,63.4) v1(59.83,62.54) v1(59.9,52.64) v1(59.9,37.01) v1(59.95,98.92) v1(59.95,61.03) v1(60,38.54) v1(60.11,75.31) v1(60.19,28.03) v1(60.21,76.74) v1(60.21,51.92) v1(60.31,53.45) v1(60.31,37.82) v1(60.44,26.43) v1(60.44,25.57) v1(60.44,24.71) v1(60.44,23.84) v1(60.44,22.98) v1(60.44,22.12) v1(60.44,21.26) v1(60.44,20.39) v1(60.44,19.53) v1(60.44,18.67) v1(60.44,17.81) v1(60.44,16.94) v1(60.57,74.49) v1(60.55,49.58) v1(60.55,48.72) v1(60.55,47.86) v1(60.55,47) v1(60.55,46.13) v1(60.55,45.27) v1(60.55,44.41) v1(60.55,43.55) v1(60.55,42.69) v1(60.55,41.82) v1(60.55,40.96) v1(60.55,40.1) v1(60.57,4.47) v1(60.65,96.1) v1(60.65,95.23) v1(60.65,94.37) v1(60.65,93.51) v1(60.65,92.65) v1(60.65,91.79) v1(60.65,90.92) v1(60.65,90.06) v1(60.65,89.2) v1(60.65,88.34) v1(60.65,87.47) v1(60.65,86.61) v1(60.67,76.02) v1(60.65,72.43) v1(60.65,71.57) v1(60.65,70.71) v1(60.65,69.85) v1(60.65,68.98) v1(60.65,68.12) v1(60.65,67.26) v1(60.65,66.4) v1(60.65,65.53) v1(60.65,64.67) v1(60.65,63.81) v1(60.65,62.95) v1(60.66,51.21) v1(60.65,28.85) v1(60.68,6) v1(60.76,52.64) v1(60.91,98.26) v1(60.97,75.31) v1(60.98,5.29) v1(61.08,76.74) v1(61.07,51.92) v1(61.05,28.03) v1(61.09,6.71) v1(61.17,53.45) v1(61.43,74.49) v1(61.44,4.47) v1(61.53,76.02) v1(61.53,51.21) v1(61.51,28.85) v1(61.54,6) v1(61.63,52.64) v1(61.84,75.31) v1(61.85,5.29) v1(61.94,76.74) v1(61.93,51.92) v1(61.92,28.03) v1(61.95,6.71) v1(62.1,98.11) v1(62.04,53.45) v1(62.29,74.49) v1(62.3,4.47) v1(62.39,76.02) v1(62.39,51.21) v1(62.37,28.85) v1(62.31,17.42) v1(62.4,6) v1(62.49,52.64) v1(62.41,24.97) v1(62.41,20.38) v1(62.41,18.95) v1(62.51,63.38) v1(62.58,26.35) v1(62.51,23.39) v1(62.51,21.81) v1(62.7,75.31) v1(62.62,70.92) v1(62.62,66.33) v1(62.62,64.91) v1(62.72,86.94) v1(62.8,76.74) v1(62.79,72.3) v1(62.72,69.34) v1(62.72,67.76) v1(62.8,51.92) v1(62.72,40.22) v1(62.78,28.03) v1(62.72,18.24) v1(62.71,5.29) v1(62.82,94.49) v1(62.82,89.9) v1(62.82,88.47) v1(62.9,53.45) v1(62.82,47.77) v1(62.82,43.18) v1(62.82,41.75) v1(62.87,24.16) v1(62.87,22.58) v1(62.87,21.1) v1(62.82,19.67) v1(62.81,6.71) v1(62.97,98.11) v1(62.99,95.86) v1(62.92,92.91) v1(62.92,91.32) v1(62.92,64.19) v1(62.99,49.15) v1(62.92,46.19) v1(62.92,44.61) v1(62.97,25.69) v1(63.07,70.11) v1(63.07,68.53) v1(63.07,67.05) v1(63.02,65.62) v1(63.12,87.75) v1(63.15,74.49) v1(63.18,71.64) v1(63.12,41.04) v1(63.17,17.42) v1(63.16,4.47) v1(63.28,93.67) v1(63.28,92.09) v1(63.28,90.61) v1(63.23,89.18) v1(63.25,76.02) v1(63.25,51.21) v1(63.28,46.95) v1(63.28,45.37) v1(63.28,43.89) v1(63.23,42.47) v1(63.23,28.85) v1(63.27,24.97) v1(63.27,20.38) v1(63.27,18.95) v1(63.26,6) v1(63.38,95.2) v1(63.38,63.38) v1(63.35,52.64) v1(63.38,48.48) v1(63.38,23.39) v1(63.38,21.81) v1(63.48,70.92) v1(63.48,66.33) v1(63.48,64.91) v1(63.44,26.35) v1(63.58,86.94) v1(63.56,75.31) v1(63.58,69.34) v1(63.58,67.76) v1(63.58,40.22) v1(63.58,18.24) v1(63.57,5.29) v1(63.68,94.49) v1(63.68,89.9) v1(63.68,88.47) v1(63.66,76.74) v1(63.65,72.3) v1(63.66,51.92) v1(63.68,47.77) v1(63.68,43.18) v1(63.68,41.75) v1(63.64,28.03) v1(63.68,19.67) v1(63.67,6.71) v1(63.78,92.91) v1(63.78,91.32) v1(63.78,64.19) v1(63.76,53.45) v1(63.78,46.19) v1(63.78,44.61) v1(63.73,24.16) v1(63.73,22.58) v1(63.73,21.1) v1(63.83,98.11) v1(63.85,95.86) v1(63.89,65.62) v1(63.85,49.15) v1(63.88,28.9) v1(63.83,25.69) v1(63.99,87.75) v1(63.94,70.11) v1(63.94,68.53) v1(63.94,67.05) v1(63.99,41.04) v1(64.09,89.18) v1(64.02,74.49) v1(64.04,71.64) v1(64.09,42.47) v1(64.03,17.42) v1(64.02,4.47) v1(64.14,93.67) v1(64.14,92.09) v1(64.14,90.61) v1(64.12,76.02) v1(64.11,51.21) v1(64.14,46.95) v1(64.14,45.37) v1(64.14,43.89) v1(64.14,24.97) v1(64.14,20.38) v1(64.14,18.95) v1(64.13,6) v1(64.24,95.2) v1(64.24,63.38) v1(64.21,52.64) v1(64.24,48.48) v1(64.29,28.08) v1(64.24,23.39) v1(64.24,21.81) v1(64.34,70.92) v1(64.34,66.33) v1(64.34,64.91) v1(64.31,26.35) v1(64.5,98.87) v1(64.44,86.94) v1(64.42,75.31) v1(64.44,69.34) v1(64.44,67.76) v1(64.44,40.22) v1(64.44,18.24) v1(64.43,5.29) v1(64.54,94.49) v1(64.54,89.9) v1(64.54,88.47) v1(64.53,76.74) v1(64.51,72.3) v1(64.52,51.92) v1(64.54,47.77) v1(64.54,43.18) v1(64.54,41.75) v1(64.59,24.16) v1(64.59,22.58) v1(64.59,21.1) v1(64.54,19.67) v1(64.53,6.71) v1(64.69,98.11) v1(64.65,92.91) v1(64.65,91.32) v1(64.65,64.19) v1(64.62,53.45) v1(64.65,46.19) v1(64.65,44.61) v1(64.7,25.69) v1(64.72,95.86) v1(64.8,70.11) v1(64.8,68.53) v1(64.8,67.05) v1(64.75,65.62) v1(64.72,49.15) v1(64.74,28.9) v1(64.85,87.75) v1(64.88,74.49) v1(64.9,71.64) v1(64.85,41.04) v1(64.9,17.42) v1(64.89,4.47) v1(65,93.67) v1(65,92.09) v1(65,90.61) v1(64.95,89.18) v1(64.98,76.02) v1(64.97,51.21) v1(65,46.95) v1(65,45.37) v1(65,43.89) v1(64.95,42.47) v1(65,24.97) v1(65,20.38) v1(65,18.95) v1(64.99,6) v1(65.1,95.2) v1(65.1,63.38) v1(65.08,52.64) v1(65.1,48.48) v1(65.1,23.39) v1(65.1,21.81) v1(65.2,70.92) v1(65.2,66.33) v1(65.2,64.91) v1(65.15,28.08) v1(65.17,26.35) v1(65.3,86.94) v1(65.29,75.31) v1(65.3,69.34) v1(65.3,67.76) v1(65.3,40.22) v1(65.3,18.24) v1(65.29,5.29) v1(65.36,98.87) v1(65.39,76.74) v1(65.37,72.3) v1(65.38,51.92) v1(65.4,6.71) v1(65.41,94.49) v1(65.41,89.9) v1(65.41,88.47) v1(65.48,53.45) v1(65.41,47.77) v1(65.41,43.18) v1(65.41,41.75) v1(65.46,24.16) v1(65.46,22.58) v1(65.46,21.1) v1(65.41,19.67) v1(65.55,98.11) v1(65.58,95.86) v1(65.51,92.91) v1(65.51,91.32) v1(65.51,64.19) v1(65.58,49.15) v1(65.51,46.19) v1(65.51,44.61) v1(65.56,25.69) v1(65.66,70.11) v1(65.66,68.53) v1(65.66,67.05) v1(65.61,65.62) v1(65.61,28.9) v1(65.71,87.75) v1(65.74,74.49) v1(65.76,71.64) v1(65.71,41.04) v1(65.76,17.42) v1(65.75,4.47) v1(65.87,93.67) v1(65.87,92.09) v1(65.87,90.61) v1(65.81,89.18) v1(65.84,76.02) v1(65.84,51.21) v1(65.87,46.95) v1(65.87,45.37) v1(65.87,43.89) v1(65.81,42.47) v1(65.86,24.97) v1(65.86,20.38) v1(65.86,18.95) v1(65.85,6) v1(65.97,95.2) v1(65.96,63.38) v1(65.94,52.64) v1(65.97,48.48) v1(65.96,23.39) v1(65.96,21.81) v1(66.06,70.92) v1(66.06,66.33) v1(66.06,64.91) v1(66.01,28.08) v1(66.03,26.35) v1(66.17,86.94) v1(66.15,75.31) v1(66.17,69.34) v1(66.17,67.76) v1(66.17,40.22) v1(66.17,18.24) v1(66.16,5.29) v1(66.23,98.87) v1(66.27,94.49) v1(66.27,89.9) v1(66.27,88.47) v1(66.25,76.74) v1(66.24,72.3) v1(66.25,51.92) v1(66.27,47.77) v1(66.27,43.18) v1(66.27,41.75) v1(66.21,37.26) v1(66.27,19.67) v1(66.26,6.71) v1(66.37,92.91) v1(66.37,91.32) v1(66.37,64.19) v1(66.35,53.45) v1(66.37,46.19) v1(66.37,44.61) v1(66.31,38.69) v1(66.32,24.16) v1(66.32,22.58) v1(66.32,21.1) v1(66.42,98.11) v1(66.44,95.86) v1(66.47,65.62) v1(66.44,49.15) v1(66.47,28.9) v1(66.42,25.69) v1(66.57,87.75) v1(66.6,74.49) v1(66.52,70.11) v1(66.52,68.53) v1(66.52,67.05) v1(66.57,41.04) v1(66.68,89.18) v1(66.7,76.02) v1(66.63,71.64) v1(66.7,51.21) v1(66.68,42.47) v1(66.66,36.45) v1(66.62,17.42) v1(66.61,4.47) v1(66.73,93.67) v1(66.73,92.09) v1(66.73,90.61) v1(66.8,52.64) v1(66.73,46.95) v1(66.73,45.37) v1(66.73,43.89) v1(66.76,37.98) v1(66.72,24.97) v1(66.72,20.38) v1(66.72,18.95) v1(66.71,6) v1(66.83,95.2) v1(66.82,63.38) v1(66.83,48.48) v1(66.88,28.08) v1(66.89,26.35) v1(66.82,23.39) v1(66.82,21.81) v1(66.93,70.92) v1(66.93,66.33) v1(66.93,64.91) v1(67.09,98.87) v1(67.03,86.94) v1(67.01,75.31) v1(67.1,72.3) v1(67.03,69.34) v1(67.03,67.76) v1(67.03,40.22) v1(67.07,37.26) v1(67.03,18.24) v1(67.02,5.29) v1(67.13,94.49) v1(67.13,89.9) v1(67.13,88.47) v1(67.11,76.74) v1(67.11,51.92) v1(67.13,47.77) v1(67.13,43.18) v1(67.13,41.75) v1(67.17,38.69) v1(67.18,24.16) v1(67.18,22.58) v1(67.18,21.1) v1(67.13,19.67) v1(67.12,6.71) v1(67.28,98.11) v1(67.3,95.86) v1(67.23,92.91) v1(67.23,91.32) v1(67.23,64.19) v1(67.21,53.45) v1(67.3,49.15) v1(67.23,46.19) v1(67.23,44.61) v1(67.28,25.69) v1(67.39,70.11) v1(67.39,68.53) v1(67.39,67.05) v1(67.34,65.62) v1(67.33,28.9) v1(67.44,87.75) v1(67.47,74.49) v1(67.49,71.64) v1(67.44,41.04) v1(67.48,17.42) v1(67.47,4.47) v1(67.59,93.67) v1(67.59,92.09) v1(67.59,90.61) v1(67.54,89.18) v1(67.57,76.02) v1(67.59,46.95) v1(67.59,45.37) v1(67.59,43.89) v1(67.54,42.47) v1(67.53,36.45) v1(67.59,24.97) v1(67.59,20.38) v1(67.59,18.95) v1(67.58,6) v1(67.69,95.2) v1(67.69,63.38) v1(67.69,48.48) v1(67.63,37.98) v1(67.69,23.39) v1(67.69,21.81) v1(67.79,70.92) v1(67.79,66.33) v1(67.79,64.91) v1(67.74,28.08) v1(67.76,26.35) v1(67.89,86.94) v1(67.87,75.31) v1(67.89,69.34) v1(67.89,67.76) v1(67.89,40.22) v1(67.89,18.24) v1(67.88,5.29) v1(67.95,98.87) v1(67.99,94.49) v1(67.99,89.9) v1(67.99,88.47) v1(67.97,76.74) v1(67.96,72.3) v1(67.99,47.77) v1(67.99,43.18) v1(67.99,41.75) v1(67.93,37.26) v1(67.99,19.67) v1(67.99,13.8) v1(67.98,6.71) v1(68.1,92.91) v1(68.1,91.32) v1(68.1,64.19) v1(68.1,46.19) v1(68.1,44.61) v1(68.03,38.69) v1(68.04,24.16) v1(68.04,22.58) v1(68.04,21.1) v1(68.1,15.23) v1(68.14,98.11) v1(68.16,95.86) v1(68.2,65.62) v1(68.16,49.15) v1(68.19,28.9) v1(68.15,25.69) v1(68.3,87.75) v1(68.25,70.11) v1(68.25,68.53) v1(68.25,67.05) v1(68.3,41.04) v1(68.4,89.18) v1(68.33,74.49) v1(68.35,71.64) v1(68.4,60.16) v1(68.4,42.47) v1(68.39,36.45) v1(68.35,17.42) v1(68.34,4.47) v1(68.45,93.67) v1(68.45,92.09) v1(68.45,90.61) v1(68.43,76.02) v1(68.5,61.59) v1(68.45,46.95) v1(68.45,45.37) v1(68.45,43.89) v1(68.49,37.98) v1(68.45,24.97) v1(68.45,20.38) v1(68.45,18.95) v1(68.45,12.99) v1(68.44,6) v1(68.55,95.2) v1(68.55,63.38) v1(68.55,48.48) v1(68.6,28.08) v1(68.55,23.39) v1(68.55,21.81) v1(68.55,14.52) v1(68.65,70.92) v1(68.65,66.33) v1(68.65,64.91) v1(68.62,26.35) v1(68.75,86.94) v1(68.73,75.31) v1(68.75,69.34) v1(68.75,67.76) v1(68.75,40.22) v1(68.8,37.26) v1(68.75,18.24) v1(68.74,5.29) v1(68.81,98.87) v1(68.86,94.49) v1(68.86,89.9) v1(68.86,88.47) v1(68.84,76.74) v1(68.82,72.3) v1(68.86,59.35) v1(68.86,47.77) v1(68.86,43.18) v1(68.86,41.75) v1(68.9,38.69) v1(68.86,19.67) v1(68.86,13.8) v1(68.85,6.71) v1(69,98.11) v1(68.96,92.91) v1(68.96,91.32) v1(68.96,64.19) v1(68.96,60.88) v1(68.96,46.19) v1(68.96,44.61) v1(68.91,24.16) v1(68.91,22.58) v1(68.91,21.1) v1(68.96,15.23) v1(69.03,95.86) v1(69.06,65.62) v1(69.03,49.15) v1(69.06,28.9) v1(69.01,25.69) v1(69.16,87.75) v1(69.13,81.94) v1(69.11,70.11) v1(69.11,68.53) v1(69.11,67.05) v1(69.16,41.04) v1(69.2,4.47) v1(69.26,89.18) v1(69.24,83.37) v1(69.21,71.64) v1(69.26,60.16) v1(69.26,42.47) v1(69.25,36.45) v1(69.21,17.42) v1(69.3,6) v1(69.31,93.67) v1(69.31,92.09) v1(69.31,90.61) v1(69.37,61.59) v1(69.31,46.95) v1(69.31,45.37) v1(69.31,43.89) v1(69.35,37.98) v1(69.31,24.97) v1(69.31,20.38) v1(69.31,18.95) v1(69.31,12.99) v1(69.42,95.2) v1(69.41,63.38) v1(69.42,48.48) v1(69.46,28.08) v1(69.48,26.35) v1(69.41,23.39) v1(69.41,21.81) v1(69.41,14.52) v1(69.54,82.65) v1(69.51,70.92) v1(69.51,66.33) v1(69.51,64.91) v1(69.68,98.87) v1(69.62,86.94) v1(69.64,84.18) v1(69.69,72.3) v1(69.62,69.34) v1(69.62,67.76) v1(69.62,40.22) v1(69.66,37.26) v1(69.62,18.24) v1(69.61,5.29) v1(69.72,94.49) v1(69.72,89.9) v1(69.72,88.47) v1(69.72,59.35) v1(69.72,47.77) v1(69.72,43.18) v1(69.72,41.75) v1(69.76,38.69) v1(69.77,24.16) v1(69.77,22.58) v1(69.77,21.1) v1(69.72,19.67) v1(69.72,13.8) v1(69.71,6.71) v1(69.87,98.11) v1(69.89,95.86) v1(69.82,92.91) v1(69.82,91.32) v1(69.82,64.19) v1(69.82,60.88) v1(69.89,49.15) v1(69.82,46.19) v1(69.82,44.61) v1(69.87,25.69) v1(69.82,15.23) v1(70,81.94) v1(69.97,70.11) v1(69.97,68.53) v1(69.97,67.05) v1(69.92,65.62) v1(69.92,28.9) v1(70.02,87.75) v1(70.1,83.37) v1(70.07,71.64) v1(70.02,41.04) v1(70.07,17.42) v1(70.06,4.47) v1(70.18,93.67) v1(70.18,92.09) v1(70.18,90.61) v1(70.13,89.18) v1(70.13,60.16) v1(70.18,46.95) v1(70.18,45.37) v1(70.18,43.89) v1(70.13,42.47) v1(70.11,36.45) v1(70.17,24.97) v1(70.17,20.38) v1(70.17,18.95) v1(70.17,12.99) v1(70.16,6) v1(70.28,95.2) v1(70.27,63.38) v1(70.23,61.59) v1(70.28,48.48) v1(70.21,37.98) v1(70.27,23.39) v1(70.27,21.81) v1(70.27,14.52) v1(70.39,75.21) v1(70.38,70.92) v1(70.38,66.33) v1(70.38,64.91) v1(70.33,28.08) v1(70.34,26.35) v1(70.48,86.94) v1(70.41,82.65) v1(70.49,76.64) v1(70.48,69.34) v1(70.48,67.76) v1(70.48,40.22) v1(70.48,18.24) v1(70.47,5.29) v1(70.54,98.87) v1(70.58,94.49) v1(70.58,89.9) v1(70.58,88.47) v1(70.51,84.18) v1(70.55,72.3) v1(70.58,59.35) v1(70.58,47.77) v1(70.58,43.18) v1(70.58,41.75) v1(70.52,37.26) v1(70.58,19.67) v1(70.58,13.8) v1(70.57,6.71) v1(70.68,92.91) v1(70.68,91.32) v1(70.68,64.19) v1(70.68,60.88) v1(70.68,46.19) v1(70.68,44.61) v1(70.62,38.69) v1(70.63,24.16) v1(70.63,22.58) v1(70.63,21.1) v1(70.68,15.23) v1(70.73,98.11) v1(70.75,95.86) v1(70.78,65.62) v1(70.75,49.15) v1(70.78,28.9) v1(70.73,25.69) v1(70.89,87.75) v1(70.86,81.94) v1(70.84,74.39) v1(70.84,70.11) v1(70.84,68.53) v1(70.84,67.05) v1(70.89,41.04) v1(70.99,89.18) v1(70.96,83.37) v1(70.95,75.92) v1(70.94,71.64) v1(70.99,60.16) v1(70.99,42.47) v1(70.93,17.42) v1(71.04,93.67) v1(71.04,92.09) v1(71.04,90.61) v1(71.09,61.59) v1(71.04,46.95) v1(71.04,45.37) v1(71.04,43.89) v1(71.03,24.97) v1(71.03,20.38) v1(71.03,18.95) v1(71.03,12.99) v1(71.14,95.2) v1(71.14,63.38) v1(71.14,48.48) v1(71.19,28.08) v1(71.14,23.39) v1(71.14,21.81) v1(71.14,14.52) v1(71.27,82.65) v1(71.25,75.21) v1(71.24,70.92) v1(71.24,66.33) v1(71.24,64.91) v1(71.21,26.35) v1(71.4,98.87) v1(71.34,86.94) v1(71.37,84.18) v1(71.35,76.64) v1(71.34,69.34) v1(71.34,67.76) v1(71.34,40.22) v1(71.34,18.24) v1(71.44,94.49) v1(71.44,89.9) v1(71.44,88.47) v1(71.41,72.3) v1(71.44,59.35) v1(71.44,47.77) v1(71.44,43.18) v1(71.44,41.75) v1(71.49,24.16) v1(71.49,22.58) v1(71.49,21.1) v1(71.44,19.67) v1(71.44,13.8) v1(71.59,98.11) v1(71.54,92.91) v1(71.54,91.32) v1(71.54,64.19) v1(71.54,60.88) v1(71.54,46.19) v1(71.54,44.61) v1(71.6,25.69) v1(71.54,15.23) v1(71.61,95.86) v1(71.7,70.11) v1(71.7,68.53) v1(71.7,67.05) v1(71.65,65.62) v1(71.61,49.15) v1(71.64,28.9) v1(71.75,87.75) v1(71.72,81.94) v1(71.71,74.39) v1(71.8,71.64) v1(71.75,41.04) v1(71.79,17.42) v1(71.9,93.67) v1(71.9,92.09) v1(71.9,90.61) v1(71.85,89.18) v1(71.82,83.37) v1(71.81,75.92) v1(71.85,60.16) v1(71.9,46.95) v1(71.9,45.37) v1(71.9,43.89) v1(71.85,42.47) v1(71.9,24.97) v1(71.9,20.38) v1(71.9,18.95) v1(71.9,12.99) v1(72,95.2) v1(72,63.38) v1(71.95,61.59) v1(72,48.48) v1(72,23.39) v1(72,21.81) v1(72,14.52) v1(72.1,70.92) v1(72.1,66.33) v1(72.1,64.91) v1(72.1,29.97) v1(72.05,28.08) v1(72.07,26.35) v1(72.2,86.94) v1(72.13,82.65) v1(72.12,75.21) v1(72.2,69.34) v1(72.2,67.76) v1(72.2,40.22) v1(72.2,18.24) v1(72.26,98.87) v1(72.23,84.18) v1(72.22,76.64) v1(72.27,72.3) v1(72.31,94.49) v1(72.31,89.9) v1(72.31,88.47) v1(72.31,59.35) v1(72.31,47.77) v1(72.31,43.18) v1(72.31,41.75) v1(72.36,24.16) v1(72.36,22.58) v1(72.36,21.1) v1(72.31,19.67) v1(72.31,13.8) v1(72.48,95.86) v1(72.41,92.91) v1(72.41,91.32) v1(72.41,64.19) v1(72.41,60.88) v1(72.48,49.15) v1(72.41,46.19) v1(72.41,44.61) v1(72.46,25.69) v1(72.41,15.23) v1(72.58,81.94) v1(72.57,74.39) v1(72.56,70.11) v1(72.56,68.53) v1(72.56,67.05) v1(72.51,65.62) v1(72.51,28.9) v1(72.61,87.75) v1(72.69,83.37) v1(72.67,75.92) v1(72.66,71.64) v1(72.61,41.04) v1(72.76,93.67) v1(72.76,92.09) v1(72.76,90.61) v1(72.71,89.18) v1(72.71,60.16) v1(72.76,46.95) v1(72.76,45.37) v1(72.76,43.89) v1(72.71,42.47) v1(72.87,95.2) v1(72.81,61.59) v1(72.87,48.48) v1(72.99,82.65) v1(72.98,75.21) v1(72.91,28.08) v1(73.09,84.18) v1(73.08,76.64) v1(73.13,98.87) v1(73.37,30.79) v1(73.37,28.9) v1(73.32,5.69) v1(73.45,81.94) v1(73.43,74.39) v1(73.43,7.22) v1(73.55,83.37) v1(73.53,75.92) v1(73.78,28.08) v1(73.73,6.51) v1(73.85,82.65) v1(73.84,75.21) v1(73.84,7.94) v1(73.99,98.87) v1(73.96,84.18) v1(73.94,76.64) v1(74.19,5.69) v1(74.29,74.39) v1(74.29,7.22) v1(74.31,81.94) v1(74.4,75.92) v1(74.41,83.37) v1(74.6,6.51) v1(74.7,75.21) v1(74.7,7.94) v1(74.72,82.65) v1(74.8,76.64) v1(74.82,84.18) v1(75.05,5.69) v1(75.17,81.94) v1(75.15,7.22) v1(75.21,98.26) v1(75.27,83.37) v1(75.31,96.58) v1(75.42,86.84) v1(75.46,6.51) v1(75.52,94.38) v1(75.52,89.79) v1(75.52,88.37) v1(75.58,82.65) v1(75.56,7.94) v1(75.69,95.76) v1(75.62,92.8) v1(75.62,91.22) v1(75.68,84.18) v1(75.71,97.39) v1(75.82,87.65) v1(75.98,93.57) v1(75.98,91.99) v1(75.98,90.51) v1(75.93,89.08) v1(75.91,5.69) v1(76.07,98.26) v1(76.08,95.1) v1(76.03,81.94) v1(76.01,7.22) v1(76.17,96.58) v1(76.14,83.37) v1(76.28,86.84) v1(76.38,94.38) v1(76.38,89.79) v1(76.38,88.37) v1(76.32,6.51) v1(76.48,92.8) v1(76.48,91.22) v1(76.44,82.65) v1(76.42,7.94) v1(76.58,97.39) v1(76.55,95.76) v1(76.54,84.18) v1(76.69,87.65) v1(76.79,89.08) v1(76.77,5.69) v1(76.84,93.57) v1(76.84,91.99) v1(76.84,90.51) v1(76.9,81.94) v1(76.88,7.22) v1(76.94,98.26) v1(76.94,95.1) v1(77,83.37) v1(77.03,96.58) v1(77.14,86.84) v1(77.18,6.51) v1(77.24,94.38) v1(77.24,89.79) v1(77.24,88.37) v1(77.3,82.65) v1(77.28,7.94) v1(77.34,92.8) v1(77.34,91.22) v1(77.44,97.39) v1(77.41,95.76) v1(77.41,84.18) v1(77.55,87.65) v1(77.7,93.57) v1(77.7,91.99) v1(77.7,90.51) v1(77.65,89.08) v1(77.64,5.69) v1(77.8,98.26) v1(77.8,95.1) v1(77.76,81.94) v1(77.74,7.22) v1(77.89,96.58) v1(77.86,83.37) v1(78,86.84) v1(78.04,6.51) v1(78.11,94.38) v1(78.11,89.79) v1(78.11,88.37) v1(78.17,82.65) v1(78.12,10.54) v1(78.15,7.94) v1(78.3,97.39) v1(78.28,95.76) v1(78.21,92.8) v1(78.21,91.22) v1(78.27,84.18) v1(78.22,12.07) v1(78.41,87.65) v1(78.5,5.69) v1(78.56,93.57) v1(78.56,91.99) v1(78.56,90.51) v1(78.51,89.08) v1(78.53,11.36) v1(78.6,7.22) v1(78.66,98.26) v1(78.67,95.1) v1(78.62,81.94) v1(78.63,12.78) v1(78.76,96.58) v1(78.72,83.37) v1(78.87,86.84) v1(78.97,94.38) v1(78.97,89.79) v1(78.97,88.37) v1(78.98,10.54) v1(78.91,6.51) v1(79.07,92.8) v1(79.07,91.22) v1(79.03,82.65) v1(79.08,12.07) v1(79.01,7.94) v1(79.16,97.39) v1(79.14,95.76) v1(79.13,84.18) v1(79.27,87.65) v1(79.38,89.08) v1(79.39,11.36) v1(79.36,5.69) v1(79.43,93.57) v1(79.43,91.99) v1(79.43,90.51) v1(79.49,12.78) v1(79.46,7.22) v1(79.52,98.26) v1(79.53,95.1) v1(79.62,96.58) v1(79.73,86.84) v1(79.77,6.51) v1(79.83,94.38) v1(79.83,89.79) v1(79.83,88.37) v1(79.84,10.54) v1(79.87,7.94) v1(80,95.76) v1(79.93,92.8) v1(79.93,91.22) v1(79.95,12.07) v1(80.03,97.39) v1(80.14,87.65) v1(80.29,93.57) v1(80.29,91.99) v1(80.29,90.51) v1(80.24,89.08) v1(80.21,82.96) v1(80.25,11.36) v1(80.22,5.69) v1(80.39,98.26) v1(80.39,95.1) v1(80.31,84.39) v1(80.35,12.78) v1(80.33,7.22) v1(80.48,96.58) v1(80.59,86.84) v1(80.69,94.38) v1(80.69,89.79) v1(80.69,88.37) v1(80.62,83.68) v1(80.63,6.51) v1(80.79,92.8) v1(80.79,91.22) v1(80.72,85.21) v1(80.72,65.93) v1(80.71,10.54) v1(80.73,7.94) v1(80.89,97.39) v1(80.86,95.76) v1(80.82,67.46) v1(80.81,12.07) v1(81,87.65) v1(81.1,89.08) v1(81.07,82.96) v1(81.09,5.69) v1(81.15,93.57) v1(81.15,91.99) v1(81.15,90.51) v1(81.18,84.39) v1(81.13,66.74) v1(81.11,11.36) v1(81.19,7.22) v1(81.25,98.26) v1(81.25,95.1) v1(81.23,68.17) v1(81.23,48.38) v1(81.22,12.78) v1(81.34,96.58) v1(81.33,49.91) v1(81.45,86.84) v1(81.48,83.68) v1(81.49,29) v1(81.49,6.51) v1(81.56,94.38) v1(81.56,89.79) v1(81.56,88.37) v1(81.58,85.21) v1(81.58,65.93) v1(81.59,30.53) v1(81.57,10.54) v1(81.6,7.94) v1(81.66,92.8) v1(81.66,91.22) v1(81.68,67.46) v1(81.64,49.2) v1(81.67,12.07) v1(81.75,97.39) v1(81.73,95.76) v1(81.74,50.63) v1(81.86,87.65) v1(81.89,29.82) v1(81.89,13.91) v1(81.96,89.08) v1(81.94,82.96) v1(81.99,66.74) v1(82,31.25) v1(82,15.44) v1(81.98,11.36) v1(81.95,5.69) v1(82.01,93.57) v1(82.01,91.99) v1(82.01,90.51) v1(82.04,84.39) v1(82.09,68.17) v1(82.09,48.38) v1(82.08,12.78) v1(82.05,7.22) v1(82.11,98.26) v1(82.2,96.58) v1(82.12,95.1) v1(82.19,49.91) v1(82.3,69.14) v1(82.3,14.72) v1(82.32,86.84) v1(82.34,83.68) v1(82.4,70.67) v1(82.4,51.65) v1(82.35,29) v1(82.4,16.15) v1(82.36,6.51) v1(82.42,94.38) v1(82.42,89.79) v1(82.42,88.37) v1(82.45,85.21) v1(82.44,65.93) v1(82.5,49.2) v1(82.45,30.53) v1(82.43,10.54) v1(82.46,7.94) v1(82.59,95.76) v1(82.52,92.8) v1(82.52,91.22) v1(82.55,67.46) v1(82.51,53.18) v1(82.6,50.63) v1(82.51,32.32) v1(82.53,12.07) v1(82.61,97.39) v1(82.61,33.85) v1(82.72,87.65) v1(82.8,82.96) v1(82.71,69.96) v1(82.76,29.82) v1(82.76,13.91) v1(82.88,93.57) v1(82.88,91.99) v1(82.88,90.51) v1(82.83,89.08) v1(82.9,84.39) v1(82.81,71.38) v1(82.85,66.74) v1(82.81,52.46) v1(82.86,31.25) v1(82.86,15.44) v1(82.84,11.36) v1(82.81,5.69) v1(82.97,98.26) v1(82.98,95.1) v1(82.95,68.17) v1(82.91,53.89) v1(82.95,48.38) v1(82.91,33.13) v1(82.94,12.78) v1(82.91,7.22) v1(83.07,96.58) v1(83.06,49.91) v1(83.02,34.56) v1(83.18,86.84) v1(83.16,69.14) v1(83.16,14.72) v1(83.28,94.38) v1(83.28,89.79) v1(83.28,88.37) v1(83.21,83.68) v1(83.27,70.67) v1(83.27,51.65) v1(83.21,29) v1(83.27,16.15) v1(83.29,10.54) v1(83.22,6.51) v1(83.38,92.8) v1(83.38,91.22) v1(83.31,85.21) v1(83.31,65.93) v1(83.37,53.18) v1(83.36,49.2) v1(83.37,32.32) v1(83.31,30.53) v1(83.4,12.07) v1(83.32,7.94) v1(83.48,97.39) v1(83.45,95.76) v1(83.41,67.46) v1(83.47,50.63) v1(83.47,33.85) v1(83.59,87.65) v1(83.57,69.96) v1(83.69,89.08) v1(83.66,82.96) v1(83.67,71.38) v1(83.67,52.46) v1(83.62,29.82) v1(83.62,13.91) v1(83.7,11.36) v1(83.74,93.57) v1(83.74,91.99) v1(83.74,90.51) v1(83.76,84.39) v1(83.72,66.74) v1(83.78,53.89) v1(83.78,33.13) v1(83.72,31.25) v1(83.72,15.44) v1(83.8,12.78) v1(83.84,98.26) v1(83.84,95.1) v1(83.82,68.17) v1(83.82,48.38) v1(83.88,34.56) v1(83.93,96.58) v1(83.92,49.91) v1(84.04,86.84) v1(84.07,83.68) v1(84.03,69.14) v1(84.07,29) v1(84.03,14.72) v1(84.14,94.38) v1(84.14,89.79) v1(84.14,88.37) v1(84.17,85.21) v1(84.13,70.67) v1(84.17,65.93) v1(84.13,51.65) v1(84.17,30.53) v1(84.13,16.15) v1(84.16,10.54) v1(84.24,92.8) v1(84.24,91.22) v1(84.27,67.46) v1(84.23,53.18) v1(84.23,49.2) v1(84.23,32.32) v1(84.26,12.07) v1(84.34,97.39) v1(84.31,95.76) v1(84.33,50.63) v1(84.33,33.85) v1(84.45,87.65) v1(84.43,69.96) v1(84.48,29.82) v1(84.48,13.91) v1(84.6,93.57) v1(84.6,91.99) v1(84.6,90.51) v1(84.55,89.08) v1(84.52,82.96) v1(84.54,71.38) v1(84.58,66.74) v1(84.54,52.46) v1(84.58,31.25) v1(84.58,15.44) v1(84.56,11.36) v1(84.7,98.26) v1(84.7,95.1) v1(84.62,84.39) v1(84.68,68.17) v1(84.64,53.89) v1(84.68,48.38) v1(84.64,33.13) v1(84.67,12.78) v1(84.79,96.58) v1(84.78,49.91) v1(84.74,34.56) v1(84.9,86.84) v1(84.89,69.14) v1(84.89,14.72) v1(85,94.38) v1(85,89.79) v1(85,88.37) v1(84.93,83.68) v1(84.99,70.67) v1(84.99,51.65) v1(84.94,29) v1(84.99,16.15) v1(85.03,85.21) v1(85.03,65.93) v1(85.09,53.18) v1(85.09,49.2) v1(85.09,32.32) v1(85.04,30.53) v1(85.02,10.54) v1(85.2,97.39) v1(85.18,95.76) v1(85.11,92.8) v1(85.11,91.22) v1(85.13,67.46) v1(85.19,50.63) v1(85.19,33.85) v1(85.12,12.07) v1(85.3,69.96) v1(85.31,87.65) v1(85.39,82.96) v1(85.4,71.38) v1(85.4,52.46) v1(85.34,29.82) v1(85.34,13.91) v1(85.46,93.57) v1(85.46,91.99) v1(85.46,90.51) v1(85.41,89.08) v1(85.49,84.39) v1(85.44,66.74) v1(85.5,53.89) v1(85.5,33.13) v1(85.44,31.25) v1(85.44,15.44) v1(85.43,11.36) v1(85.57,95.1) v1(85.54,68.17) v1(85.54,48.38) v1(85.6,34.56) v1(85.53,12.78) v1(85.64,49.91) v1(85.79,83.68) v1(85.75,69.14) v1(85.8,29) v1(85.75,14.72) v1(85.9,85.21) v1(85.85,70.67) v1(85.89,65.93) v1(85.85,51.65) v1(85.9,30.53) v1(85.85,16.15) v1(85.88,10.54) v1(86,67.46) v1(85.95,53.18) v1(85.95,49.2) v1(85.95,32.32) v1(85.98,12.07) v1(86.05,50.63) v1(86.06,33.85) v1(86.16,69.96) v1(86.2,29.82) v1(86.2,13.91) v1(86.25,82.96) v1(86.26,71.38) v1(86.3,66.74) v1(86.26,52.46) v1(86.29,11.36) v1(86.37,86.43) v1(86.35,84.39) v1(86.4,68.17) v1(86.36,53.89) v1(86.4,48.38) v1(86.36,33.13) v1(86.31,31.25) v1(86.31,15.44) v1(86.39,12.78) v1(86.47,34.56) v1(86.51,49.91) v1(86.68,87.45) v1(86.66,83.68) v1(86.61,69.14) v1(86.66,29) v1(86.61,14.72) v1(86.76,85.21) v1(86.72,70.67) v1(86.76,65.93) v1(86.72,51.65) v1(86.76,30.53) v1(86.72,16.15) v1(86.74,10.54) v1(86.86,67.46) v1(86.82,53.18) v1(86.81,49.2) v1(86.82,32.32) v1(86.84,12.07) v1(86.91,50.63) v1(86.92,33.85) v1(87.02,69.96) v1(87.07,29.82) v1(87.07,13.91) v1(87.11,82.96) v1(87.12,71.38) v1(87.16,66.74) v1(87.12,52.46) v1(87.17,31.25) v1(87.17,15.44) v1(87.15,11.36) v1(87.23,88.42) v1(87.21,84.39) v1(87.27,68.17) v1(87.22,53.89) v1(87.27,48.38) v1(87.22,33.13) v1(87.25,12.78) v1(87.37,49.91) v1(87.33,34.56) v1(87.48,69.14) v1(87.48,14.72) v1(87.52,83.68) v1(87.58,70.67) v1(87.58,51.65) v1(87.52,29) v1(87.58,16.15) v1(87.62,85.21) v1(87.62,65.93) v1(87.68,53.18) v1(87.67,49.2) v1(87.68,32.32) v1(87.62,30.53) v1(87.61,10.54) v1(87.72,67.46) v1(87.78,50.63) v1(87.78,33.85) v1(87.71,12.07) v1(87.88,69.96) v1(87.97,82.96) v1(87.99,71.38) v1(87.99,52.46) v1(87.93,29.82) v1(87.93,13.91) v1(88.07,84.39) v1(88.03,66.74) v1(88.09,53.89) v1(88.09,33.13) v1(88.03,31.25) v1(88.03,15.44) v1(88.01,11.36) v1(88.11,86.73) v1(88.13,68.17) v1(88.13,48.38) v1(88.19,34.56) v1(88.12,12.78) v1(88.23,49.91) v1(88.38,83.68) v1(88.34,69.14) v1(88.38,29) v1(88.34,14.72) v1(88.41,86.02) v1(88.48,85.21) v1(88.44,70.67) v1(88.48,65.93) v1(88.44,51.65) v1(88.49,30.53) v1(88.44,16.15) v1(88.51,87.55) v1(88.58,67.46) v1(88.54,53.18) v1(88.54,49.2) v1(88.54,32.32) v1(88.64,50.63) v1(88.64,33.85) v1(88.75,69.96) v1(88.79,29.82) v1(88.79,13.91) v1(88.84,82.96) v1(88.85,71.38) v1(88.89,66.74) v1(88.85,52.46) v1(88.89,31.25) v1(88.89,15.44) v1(88.97,86.73) v1(88.94,84.39) v1(88.99,68.17) v1(88.95,53.89) v1(88.99,48.38) v1(88.95,33.13) v1(89.09,49.91) v1(89.05,34.56) v1(89.2,69.14) v1(89.2,14.72) v1(89.28,86.02) v1(89.24,83.68) v1(89.3,70.67) v1(89.3,51.65) v1(89.25,29) v1(89.3,16.15) v1(89.38,87.55) v1(89.34,85.21) v1(89.34,65.93) v1(89.4,53.18) v1(89.4,49.2) v1(89.4,32.32) v1(89.35,30.53) v1(89.45,67.46) v1(89.5,50.63) v1(89.51,33.85) v1(89.7,82.96) v1(89.61,69.96) v1(89.65,29.82) v1(89.65,13.91) v1(89.8,84.39) v1(89.71,71.38) v1(89.75,66.74) v1(89.71,52.46) v1(89.76,31.25) v1(89.76,15.44) v1(89.83,86.73) v1(89.85,68.17) v1(89.81,53.89) v1(89.85,48.38) v1(89.81,33.13) v1(89.96,49.91) v1(89.91,34.56) v1(90.06,69.14) v1(90.06,14.72) v1(90.14,86.02) v1(90.11,83.68) v1(90.16,70.67) v1(90.16,51.65) v1(90.11,29) v1(90.16,16.15) v1(90.24,87.55) v1(90.21,85.21) v1(90.21,65.93) v1(90.27,53.18) v1(90.26,49.2) v1(90.27,32.32) v1(90.21,30.53) v1(90.31,67.46) v1(90.36,50.63) v1(90.37,33.85) v1(90.47,69.96) v1(90.57,71.38) v1(90.57,52.46) v1(90.52,29.82) v1(90.52,13.91) v1(90.69,86.73) v1(90.61,66.74) v1(90.67,53.89) v1(90.67,33.13) v1(90.62,31.25) v1(90.62,15.44) v1(90.72,68.17) v1(90.72,48.38) v1(90.78,34.56) v1(90.82,49.91) v1(91,86.02) v1(90.92,69.14) v1(90.97,29) v1(90.92,14.72) v1(91.1,87.55) v1(91.03,70.67) v1(91.03,51.65) v1(91.07,30.53) v1(91.03,16.15) v1(91.13,53.18) v1(91.12,49.2) v1(91.13,32.32) v1(91.23,50.63) v1(91.23,33.85) v1(91.33,69.96) v1(91.38,29.82) v1(91.38,13.91) v1(91.45,85.31) v1(91.44,71.38) v1(91.44,52.46) v1(91.48,31.25) v1(91.48,15.44) v1(91.56,86.73) v1(91.54,53.89) v1(91.54,33.13) v1(91.64,34.56) v1(91.71,83.27) v1(91.79,69.14) v1(91.79,14.72) v1(91.86,86.02) v1(91.89,70.67) v1(91.89,51.65) v1(91.89,16.15) v1(91.96,87.55) v1(92,75.26) v1(91.99,53.18) v1(91.99,32.32) v1(92.09,33.85) v1(92.2,69.96) v1(92.3,71.38) v1(92.3,52.46) v1(92.32,85.31) v1(92.4,53.89) v1(92.4,33.13) v1(92.42,86.73) v1(92.5,34.56) v1(92.62,73.78) v1(92.72,86.02) v1(92.83,87.55) v1(93.28,86.73) v1(93.29,15.38) v1(93.39,16.81) v1(93.59,86.02) v1(93.69,87.55) v1(93.85,16.1) v1(94.14,86.73) v1(94.15,15.38) v1(94.25,16.81) v1(94.45,86.02) v1(94.55,87.55) v1(94.75,72.61) v1(94.71,16.1) v1(95.01,86.73) v1(95.01,15.38) v1(95.12,16.81) v1(95.31,86.02) v1(95.41,87.55) v1(95.57,16.1) v1(95.77,85.31) v1(95.87,86.73) v1(95.88,15.38) v1(95.98,16.81) v1(96.17,86.02) v1(96.28,87.55) v1(96.33,14.57) v1(96.43,16.1) v1(96.63,85.31) v1(96.73,86.73) v1(96.74,15.38) v1(96.84,16.81) v1(96.85,13.85) v1(96.96,20.03) v1(97,18.55) v1(97.04,86.02) v1(97.14,87.55) v1(97.19,14.57) v1(97.3,16.1) v1(97.49,85.31) v1(97.59,86.73) v1(97.6,15.38) v1(97.67,38.77) v1(97.67,37.91) v1(97.67,37.05) v1(97.67,36.19) v1(97.67,35.32) v1(97.67,34.46) v1(97.67,33.6) v1(97.67,32.74) v1(97.67,31.87) v1(97.67,31.01) v1(97.67,30.15) v1(97.67,29.29) v1(97.7,16.81) v1(97.9,86.02) v1(97.86,82.09) v1(97.86,81.23) v1(97.86,80.36) v1(97.86,79.5) v1(97.86,78.64) v1(97.86,77.78) v1(97.86,76.92) v1(97.86,76.05) v1(97.86,75.19) v1(97.86,74.33) v1(97.86,73.47) v1(97.86,72.6) v1(97.86,70.66) v1(97.86,69.79) v1(97.86,68.93) v1(97.86,68.07) v1(97.86,67.21) v1(97.86,66.34) v1(97.86,65.48) v1(97.86,64.62) v1(97.86,63.76) v1(97.86,62.89) v1(97.86,62.03) v1(97.86,61.17) v1(97.86,60.12) v1(97.86,59.26) v1(97.86,58.39) v1(97.86,57.53) v1(97.86,56.67) v1(97.86,55.81) v1(97.86,54.95) v1(97.86,54.08) v1(97.86,53.22) v1(97.86,52.36) v1(97.86,51.5) v1(97.86,50.63) v1(97.86,49.53) v1(97.86,48.67) v1(97.86,47.81) v1(97.86,46.95) v1(97.86,46.08) v1(97.86,45.22) v1(97.86,44.36) v1(97.86,43.5) v1(97.86,42.64) v1(97.86,41.77) v1(97.86,40.91) v1(97.86,40.05) v1(98,87.55) v1(97.98,27.76) v1(97.98,26.89) v1(97.98,26.03) v1(97.98,25.17) v1(97.98,24.31) v1(97.98,23.44) v1(97.98,22.58) v1(97.98,21.72) v1(97.98,20.86) v1(97.98,19.99) v1(97.98,19.13) v1(97.98,18.27) v1(98.49,38.36) v1(98.49,37.5) v1(98.49,36.64) v1(98.49,35.78) v1(98.49,34.91) v1(98.49,34.05) v1(98.49,33.19) v1(98.49,32.33) v1(98.49,31.47) v1(98.49,30.6) v1(98.49,29.74) v1(98.49,28.88) v1(98.68,81.68) v1(98.68,80.82) v1(98.68,79.96) v1(98.68,79.09) v1(98.68,78.23) v1(98.68,77.37) v1(98.68,76.51) v1(98.68,75.64) v1(98.68,74.78) v1(98.68,73.92) v1(98.68,73.06) v1(98.68,72.2) v1(98.68,70.25) v1(98.68,69.38) v1(98.68,68.52) v1(98.68,67.66) v1(98.68,66.8) v1(98.68,65.94) v1(98.68,65.07) v1(98.68,64.21) v1(98.68,63.35) v1(98.68,62.49) v1(98.68,61.62) v1(98.68,60.76) v1(98.68,59.71) v1(98.68,58.85) v1(98.68,57.99) v1(98.68,57.12) v1(98.68,56.26) v1(98.68,55.4) v1(98.68,54.54) v1(98.68,53.68) v1(98.68,52.81) v1(98.68,51.95) v1(98.68,51.09) v1(98.68,50.23) v1(98.68,49.13) v1(98.68,48.26) v1(98.68,47.4) v1(98.68,46.54) v1(98.68,45.68) v1(98.68,44.81) v1(98.68,43.95) v1(98.68,43.09) v1(98.68,42.23) v1(98.68,41.36) v1(98.68,40.5) v1(98.68,39.64) v1(98.8,27.35) v1(98.8,26.49) v1(98.8,25.62) v1(98.8,24.76) v1(98.8,23.9) v1(98.8,23.04) v1(98.8,22.17) v1(98.8,21.31) v1(98.8,20.45) v1(98.8,19.59) v1(98.8,18.72) v1(98.8,17.86)
